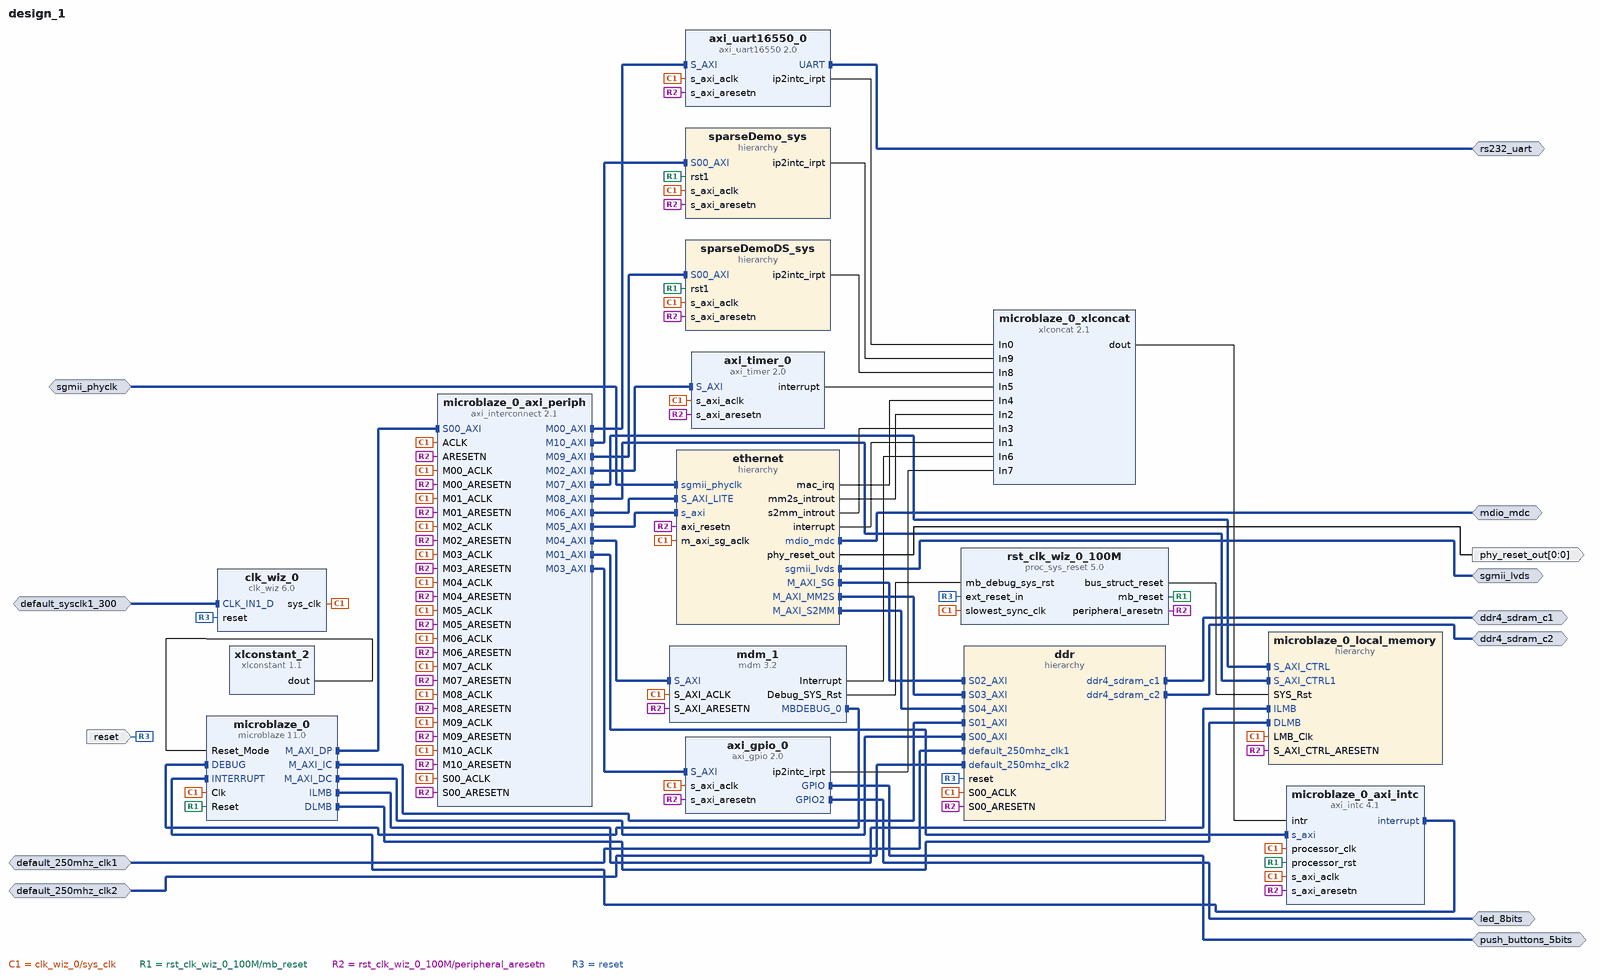
[diagram p0: block diagram of the top level]
# Vivado block design design_1, xcvu9p-flga2104-2L-e, Vivado 2019.1_AR72944
create_bd_design design_1

create_bd_intf_port -mode Master -vlnv xilinx.com:interface:ddr4_rtl:1.0 ddr4_sdram_c1
create_bd_intf_port -mode Slave -vlnv xilinx.com:interface:diff_clock_rtl:1.0 default_250mhz_clk1
set_property -dict {CONFIG.FREQ_HZ 250000000} [get_bd_intf_ports default_250mhz_clk1]
create_bd_intf_port -mode Master -vlnv xilinx.com:interface:ddr4_rtl:1.0 ddr4_sdram_c2
create_bd_intf_port -mode Slave -vlnv xilinx.com:interface:diff_clock_rtl:1.0 default_250mhz_clk2
set_property -dict {CONFIG.FREQ_HZ 250000000} [get_bd_intf_ports default_250mhz_clk2]
create_bd_intf_port -mode Master -vlnv xilinx.com:interface:uart_rtl:1.0 rs232_uart
create_bd_intf_port -mode Slave -vlnv xilinx.com:interface:diff_clock_rtl:1.0 default_sysclk1_300
set_property -dict {CONFIG.FREQ_HZ 300000000} [get_bd_intf_ports default_sysclk1_300]
create_bd_intf_port -mode Master -vlnv xilinx.com:interface:gpio_rtl:1.0 push_buttons_5bits
create_bd_intf_port -mode Master -vlnv xilinx.com:interface:gpio_rtl:1.0 led_8bits
create_bd_intf_port -mode Master -vlnv xilinx.com:interface:sgmii_rtl:1.0 sgmii_lvds
create_bd_intf_port -mode Master -vlnv xilinx.com:interface:mdio_rtl:1.0 mdio_mdc
create_bd_intf_port -mode Slave -vlnv xilinx.com:interface:diff_clock_rtl:1.0 sgmii_phyclk
set_property -dict {CONFIG.FREQ_HZ 625000000} [get_bd_intf_ports sgmii_phyclk]
create_bd_port -dir I -type rst reset
set_property -dict {CONFIG.POLARITY ACTIVE_HIGH} [get_bd_ports reset]
create_bd_port -dir O -from 0 -to 0 -type rst phy_reset_out

create_bd_cell -type ip -vlnv xilinx.com:ip:clk_wiz:6.0 clk_wiz_0
set_property -dict [list \
  CONFIG.CLKOUT1_JITTER 93.717 \
  CONFIG.CLKOUT1_REQUESTED_OUT_FREQ 150 \
  CONFIG.CLK_IN1_BOARD_INTERFACE default_sysclk1_300 \
  CONFIG.CLK_OUT1_PORT sys_clk \
  CONFIG.MMCM_CLKOUT0_DIVIDE_F 8.000 \
  CONFIG.RESET_BOARD_INTERFACE reset \
  CONFIG.USE_BOARD_FLOW true \
  CONFIG.USE_LOCKED false \
] [get_bd_cells clk_wiz_0]
create_bd_cell -type ip -vlnv xilinx.com:ip:xlconcat:2.1 microblaze_0_xlconcat
set_property -dict {CONFIG.NUM_PORTS 10} [get_bd_cells microblaze_0_xlconcat]
create_bd_cell -type ip -vlnv xilinx.com:ip:mdm:3.2 mdm_1
set_property -dict [list \
  CONFIG.C_ADDR_SIZE 32 \
  CONFIG.C_DBG_MEM_ACCESS 0 \
  CONFIG.C_M_AXI_ADDR_WIDTH 32 \
  CONFIG.C_USE_CROSS_TRIGGER 0 \
  CONFIG.C_USE_UART 1 \
] [get_bd_cells mdm_1]
create_bd_cell -type ip -vlnv xilinx.com:ip:proc_sys_reset:5.0 rst_clk_wiz_0_100M
set_property -dict {CONFIG.RESET_BOARD_INTERFACE reset CONFIG.USE_BOARD_FLOW true} [get_bd_cells rst_clk_wiz_0_100M]
create_bd_cell -type ip -vlnv xilinx.com:ip:xlconstant:1.1 xlconstant_2
set_property -dict {CONFIG.CONST_VAL 0b10 CONFIG.CONST_WIDTH 2} [get_bd_cells xlconstant_2]
create_bd_cell -type ip -vlnv xilinx.com:ip:microblaze:11.0 microblaze_0
set_property -dict [list \
  CONFIG.C_ADDR_SIZE 36 \
  CONFIG.C_ADDR_TAG_BITS 16 \
  CONFIG.C_CACHE_BYTE_SIZE 65536 \
  CONFIG.C_DATA_SIZE 64 \
  CONFIG.C_DCACHE_ADDR_TAG 16 \
  CONFIG.C_DCACHE_BYTE_SIZE 65536 \
  CONFIG.C_DCACHE_DATA_WIDTH 2 \
  CONFIG.C_DCACHE_USE_WRITEBACK 1 \
  CONFIG.C_DEBUG_ENABLED 1 \
  CONFIG.C_DIV_ZERO_EXCEPTION 1 \
  CONFIG.C_D_AXI 1 \
  CONFIG.C_D_LMB 1 \
  CONFIG.C_ENABLE_DISCRETE_PORTS 1 \
  CONFIG.C_FPU_EXCEPTION 1 \
  CONFIG.C_ICACHE_LINE_LEN 8 \
  CONFIG.C_ICACHE_STREAMS 1 \
  CONFIG.C_ICACHE_VICTIMS 8 \
  CONFIG.C_ILL_OPCODE_EXCEPTION 1 \
  CONFIG.C_I_LMB 1 \
  CONFIG.C_MMU_DTLB_SIZE 8 \
  CONFIG.C_MMU_ITLB_SIZE 8 \
  CONFIG.C_MMU_ZONES 2 \
  CONFIG.C_M_AXI_D_BUS_EXCEPTION 1 \
  CONFIG.C_M_AXI_I_BUS_EXCEPTION 1 \
  CONFIG.C_NUMBER_OF_PC_BRK 8 \
  CONFIG.C_NUMBER_OF_RD_ADDR_BRK 4 \
  CONFIG.C_NUMBER_OF_WR_ADDR_BRK 4 \
  CONFIG.C_OPCODE_0x0_ILLEGAL 1 \
  CONFIG.C_PVR 2 \
  CONFIG.C_UNALIGNED_EXCEPTIONS 1 \
  CONFIG.C_USE_BARREL 1 \
  CONFIG.C_USE_BRANCH_TARGET_CACHE 1 \
  CONFIG.C_USE_DCACHE 1 \
  CONFIG.C_USE_DIV 1 \
  CONFIG.C_USE_FPU 2 \
  CONFIG.C_USE_HW_MUL 2 \
  CONFIG.C_USE_ICACHE 1 \
  CONFIG.C_USE_MMU 3 \
  CONFIG.C_USE_MSR_INSTR 1 \
  CONFIG.C_USE_PCMP_INSTR 1 \
  CONFIG.G_TEMPLATE_LIST 10 \
  CONFIG.G_USE_EXCEPTIONS 1 \
] [get_bd_cells microblaze_0]
create_bd_cell -type ip -vlnv xilinx.com:ip:axi_intc:4.1 microblaze_0_axi_intc
set_property -dict {CONFIG.C_HAS_FAST 1} [get_bd_cells microblaze_0_axi_intc]
create_bd_cell -type ip -vlnv xilinx.com:ip:axi_timer:2.0 axi_timer_0
create_bd_cell -type ip -vlnv xilinx.com:ip:axi_gpio:2.0 axi_gpio_0
set_property -dict [list \
  CONFIG.C_INTERRUPT_PRESENT 1 \
  CONFIG.GPIO2_BOARD_INTERFACE led_8bits \
  CONFIG.GPIO_BOARD_INTERFACE push_buttons_5bits \
  CONFIG.USE_BOARD_FLOW true \
] [get_bd_cells axi_gpio_0]
create_bd_cell -type ip -vlnv xilinx.com:ip:axi_uart16550:2.0 axi_uart16550_0
set_property -dict {CONFIG.UART_BOARD_INTERFACE rs232_uart CONFIG.USE_BOARD_FLOW true} [get_bd_cells axi_uart16550_0]
create_bd_cell -type ip -vlnv xilinx.com:ip:axi_interconnect:2.1 microblaze_0_axi_periph
set_property -dict {CONFIG.NUM_MI 11} [get_bd_cells microblaze_0_axi_periph]
create_bd_cell -type hier microblaze_0_local_memory
create_bd_cell -type hier ddr
create_bd_cell -type hier ethernet
create_bd_cell -type hier sparseDemo_sys
create_bd_cell -type hier sparseDemoDS_sys

# ---- hierarchy /microblaze_0_local_memory ----
current_bd_instance /microblaze_0_local_memory
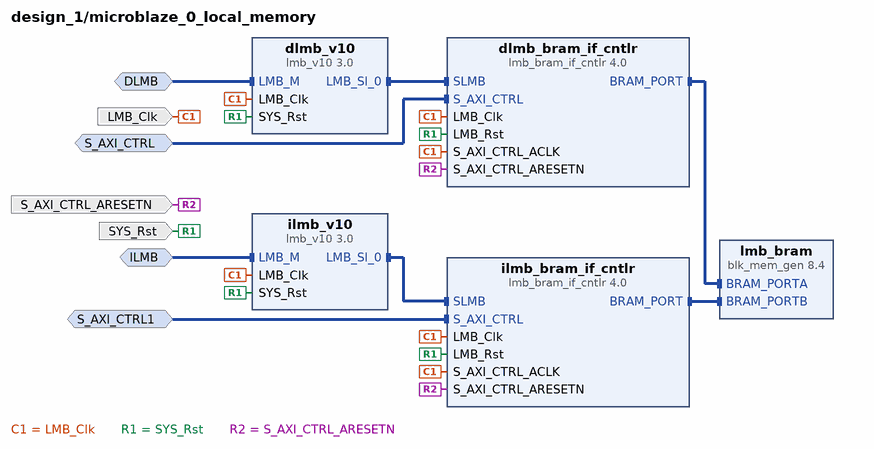
[diagram p1: block diagram inside /microblaze_0_local_memory]
create_bd_intf_pin -mode MirroredMaster -vlnv xilinx.com:interface:lmb_rtl:1.0 DLMB
create_bd_intf_pin -mode MirroredMaster -vlnv xilinx.com:interface:lmb_rtl:1.0 ILMB
create_bd_intf_pin -mode Slave -vlnv xilinx.com:interface:aximm_rtl:1.0 S_AXI_CTRL
create_bd_intf_pin -mode Slave -vlnv xilinx.com:interface:aximm_rtl:1.0 S_AXI_CTRL1
create_bd_pin -dir I -type clk LMB_Clk
create_bd_pin -dir I -type rst SYS_Rst
create_bd_pin -dir I -type rst S_AXI_CTRL_ARESETN

create_bd_cell -type ip -vlnv xilinx.com:ip:lmb_v10:3.0 dlmb_v10
create_bd_cell -type ip -vlnv xilinx.com:ip:lmb_v10:3.0 ilmb_v10
create_bd_cell -type ip -vlnv xilinx.com:ip:blk_mem_gen:8.4 lmb_bram
set_property -dict [list \
  CONFIG.Assume_Synchronous_Clk false \
  CONFIG.EN_SAFETY_CKT true \
  CONFIG.Memory_Type True_Dual_Port_RAM \
  CONFIG.Operating_Mode_A WRITE_FIRST \
  CONFIG.Operating_Mode_B WRITE_FIRST \
  CONFIG.PRIM_type_to_Implement BRAM \
  CONFIG.use_bram_block BRAM_Controller \
] [get_bd_cells lmb_bram]
create_bd_cell -type ip -vlnv xilinx.com:ip:lmb_bram_if_cntlr:4.0 dlmb_bram_if_cntlr
set_property -dict [list \
  CONFIG.C_CE_COUNTER_WIDTH 20 \
  CONFIG.C_CE_FAILING_REGISTERS 1 \
  CONFIG.C_ECC 1 \
  CONFIG.C_ECC_ONOFF_REGISTER 1 \
  CONFIG.C_ECC_STATUS_REGISTERS 1 \
  CONFIG.C_FAULT_INJECT 1 \
  CONFIG.C_INTERCONNECT 2 \
  CONFIG.C_NUM_LMB 1 \
  CONFIG.C_UE_FAILING_REGISTERS 1 \
] [get_bd_cells dlmb_bram_if_cntlr]
create_bd_cell -type ip -vlnv xilinx.com:ip:lmb_bram_if_cntlr:4.0 ilmb_bram_if_cntlr
set_property -dict [list \
  CONFIG.C_CE_COUNTER_WIDTH 20 \
  CONFIG.C_CE_FAILING_REGISTERS 1 \
  CONFIG.C_ECC 1 \
  CONFIG.C_ECC_ONOFF_REGISTER 1 \
  CONFIG.C_ECC_STATUS_REGISTERS 1 \
  CONFIG.C_INTERCONNECT 2 \
  CONFIG.C_UE_FAILING_REGISTERS 1 \
  CONFIG.C_WRITE_ACCESS 0 \
] [get_bd_cells ilmb_bram_if_cntlr]

# ---- hierarchy /ddr ----
current_bd_instance /ddr
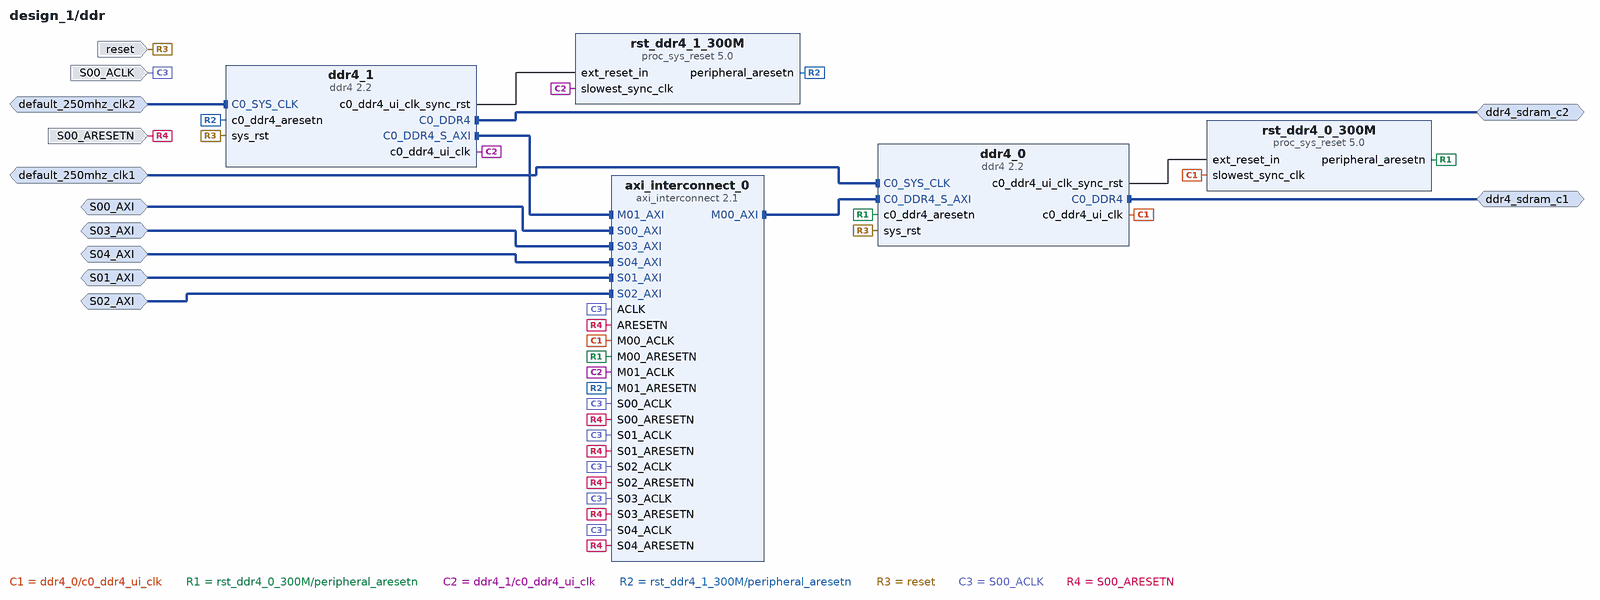
[diagram p2: block diagram inside /ddr]
create_bd_intf_pin -mode Slave -vlnv xilinx.com:interface:diff_clock_rtl:1.0 default_250mhz_clk1
create_bd_intf_pin -mode Master -vlnv xilinx.com:interface:ddr4_rtl:1.0 ddr4_sdram_c1
create_bd_intf_pin -mode Slave -vlnv xilinx.com:interface:diff_clock_rtl:1.0 default_250mhz_clk2
create_bd_intf_pin -mode Master -vlnv xilinx.com:interface:ddr4_rtl:1.0 ddr4_sdram_c2
create_bd_intf_pin -mode Slave -vlnv xilinx.com:interface:aximm_rtl:1.0 S00_AXI
create_bd_intf_pin -mode Slave -vlnv xilinx.com:interface:aximm_rtl:1.0 S01_AXI
create_bd_intf_pin -mode Slave -vlnv xilinx.com:interface:aximm_rtl:1.0 S02_AXI
create_bd_intf_pin -mode Slave -vlnv xilinx.com:interface:aximm_rtl:1.0 S03_AXI
create_bd_intf_pin -mode Slave -vlnv xilinx.com:interface:aximm_rtl:1.0 S04_AXI
create_bd_pin -dir I -type rst reset
create_bd_pin -dir I -type clk S00_ACLK
create_bd_pin -dir I -type rst S00_ARESETN

create_bd_cell -type ip -vlnv xilinx.com:ip:ddr4:2.2 ddr4_0
set_property -dict [list \
  CONFIG.ADDN_UI_CLKOUT1_FREQ_HZ None \
  CONFIG.C0.BANK_GROUP_WIDTH 1 \
  CONFIG.C0.DDR4_AxiAddressWidth 31 \
  CONFIG.C0_CLOCK_BOARD_INTERFACE default_250mhz_clk1 \
  CONFIG.C0_DDR4_BOARD_INTERFACE ddr4_sdram_c1 \
  CONFIG.RESET_BOARD_INTERFACE reset \
] [get_bd_cells ddr4_0]
create_bd_cell -type ip -vlnv xilinx.com:ip:proc_sys_reset:5.0 rst_ddr4_0_300M
create_bd_cell -type ip -vlnv xilinx.com:ip:ddr4:2.2 ddr4_1
set_property -dict [list \
  CONFIG.ADDN_UI_CLKOUT1_FREQ_HZ None \
  CONFIG.C0.BANK_GROUP_WIDTH 1 \
  CONFIG.C0.DDR4_AxiAddressWidth 31 \
  CONFIG.C0_CLOCK_BOARD_INTERFACE default_250mhz_clk2 \
  CONFIG.C0_DDR4_BOARD_INTERFACE ddr4_sdram_c2 \
  CONFIG.RESET_BOARD_INTERFACE reset \
] [get_bd_cells ddr4_1]
create_bd_cell -type ip -vlnv xilinx.com:ip:proc_sys_reset:5.0 rst_ddr4_1_300M
create_bd_cell -type ip -vlnv xilinx.com:ip:axi_interconnect:2.1 axi_interconnect_0
set_property -dict [list \
  CONFIG.ENABLE_ADVANCED_OPTIONS 0 \
  CONFIG.M00_HAS_DATA_FIFO 2 \
  CONFIG.M00_HAS_REGSLICE 4 \
  CONFIG.M01_HAS_DATA_FIFO 2 \
  CONFIG.M01_HAS_REGSLICE 4 \
  CONFIG.NUM_MI 2 \
  CONFIG.NUM_SI 5 \
  CONFIG.S00_HAS_DATA_FIFO 2 \
  CONFIG.S00_HAS_REGSLICE 4 \
  CONFIG.S01_HAS_DATA_FIFO 2 \
  CONFIG.S01_HAS_REGSLICE 4 \
  CONFIG.S02_HAS_DATA_FIFO 2 \
  CONFIG.S02_HAS_REGSLICE 4 \
  CONFIG.S03_HAS_DATA_FIFO 2 \
  CONFIG.S03_HAS_REGSLICE 4 \
  CONFIG.S04_HAS_DATA_FIFO 2 \
  CONFIG.S04_HAS_REGSLICE 4 \
  CONFIG.STRATEGY 2 \
] [get_bd_cells axi_interconnect_0]

# ---- hierarchy /ethernet ----
current_bd_instance /ethernet
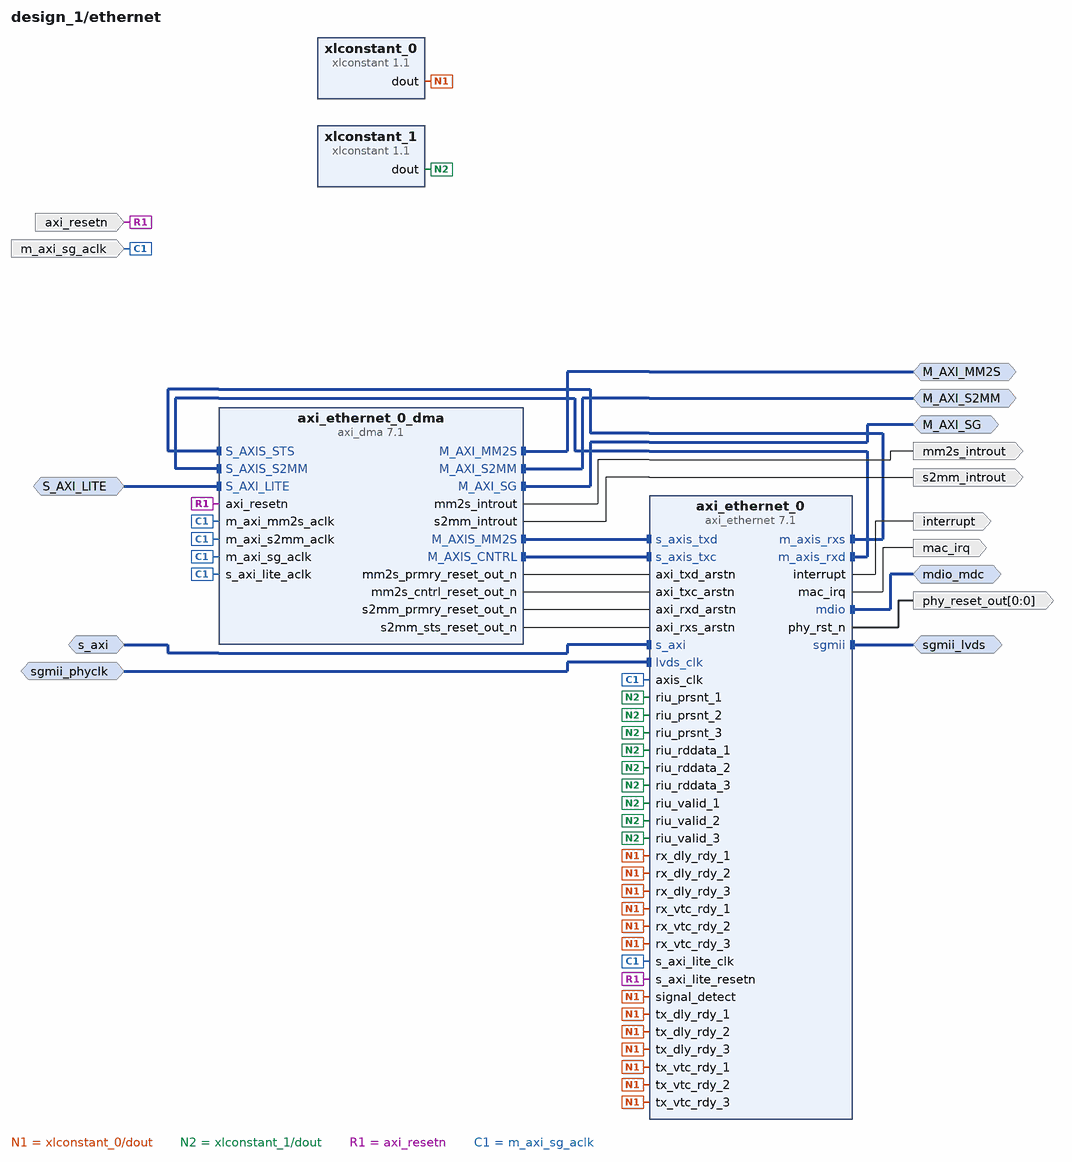
[diagram p3: block diagram inside /ethernet]
create_bd_intf_pin -mode Slave -vlnv xilinx.com:interface:aximm_rtl:1.0 s_axi
create_bd_intf_pin -mode Master -vlnv xilinx.com:interface:mdio_rtl:1.0 mdio_mdc
create_bd_intf_pin -mode Master -vlnv xilinx.com:interface:sgmii_rtl:1.0 sgmii_lvds
create_bd_intf_pin -mode Slave -vlnv xilinx.com:interface:diff_clock_rtl:1.0 sgmii_phyclk
create_bd_intf_pin -mode Slave -vlnv xilinx.com:interface:aximm_rtl:1.0 S_AXI_LITE
create_bd_intf_pin -mode Master -vlnv xilinx.com:interface:aximm_rtl:1.0 M_AXI_SG
create_bd_intf_pin -mode Master -vlnv xilinx.com:interface:aximm_rtl:1.0 M_AXI_MM2S
create_bd_intf_pin -mode Master -vlnv xilinx.com:interface:aximm_rtl:1.0 M_AXI_S2MM
create_bd_pin -dir I -type rst axi_resetn
create_bd_pin -dir I -type clk m_axi_sg_aclk
create_bd_pin -dir O -type intr mac_irq
create_bd_pin -dir O -type intr interrupt
create_bd_pin -dir O -from 0 -to 0 -type rst phy_reset_out
create_bd_pin -dir O -type intr mm2s_introut
create_bd_pin -dir O -type intr s2mm_introut

create_bd_cell -type ip -vlnv xilinx.com:ip:xlconstant:1.1 xlconstant_0
create_bd_cell -type ip -vlnv xilinx.com:ip:axi_ethernet:7.1 axi_ethernet_0
set_property -dict [list \
  CONFIG.DIFFCLK_BOARD_INTERFACE sgmii_phyclk \
  CONFIG.ETHERNET_BOARD_INTERFACE sgmii_lvds \
  CONFIG.MCAST_EXTEND true \
  CONFIG.MDIO_BOARD_INTERFACE mdio_mdc \
  CONFIG.PHYRST_BOARD_INTERFACE phy_reset_out \
  CONFIG.RXCSUM Full \
  CONFIG.RXVLAN_STRP true \
  CONFIG.RXVLAN_TAG true \
  CONFIG.RXVLAN_TRAN true \
  CONFIG.TXCSUM Full \
  CONFIG.TXVLAN_STRP true \
  CONFIG.TXVLAN_TAG true \
  CONFIG.TXVLAN_TRAN true \
  CONFIG.axiliteclkrate 200 \
  CONFIG.axisclkrate 200 \
] [get_bd_cells axi_ethernet_0]
create_bd_cell -type ip -vlnv xilinx.com:ip:axi_dma:7.1 axi_ethernet_0_dma
set_property -dict [list \
  CONFIG.c_addr_width 36 \
  CONFIG.c_include_mm2s_dre 1 \
  CONFIG.c_include_s2mm_dre 1 \
  CONFIG.c_sg_length_width 16 \
  CONFIG.c_sg_use_stsapp_length 1 \
] [get_bd_cells axi_ethernet_0_dma]
create_bd_cell -type ip -vlnv xilinx.com:ip:xlconstant:1.1 xlconstant_1
set_property -dict {CONFIG.CONST_VAL 0 CONFIG.CONST_WIDTH 16} [get_bd_cells xlconstant_1]

# ---- hierarchy /sparseDemo_sys ----
current_bd_instance /sparseDemo_sys
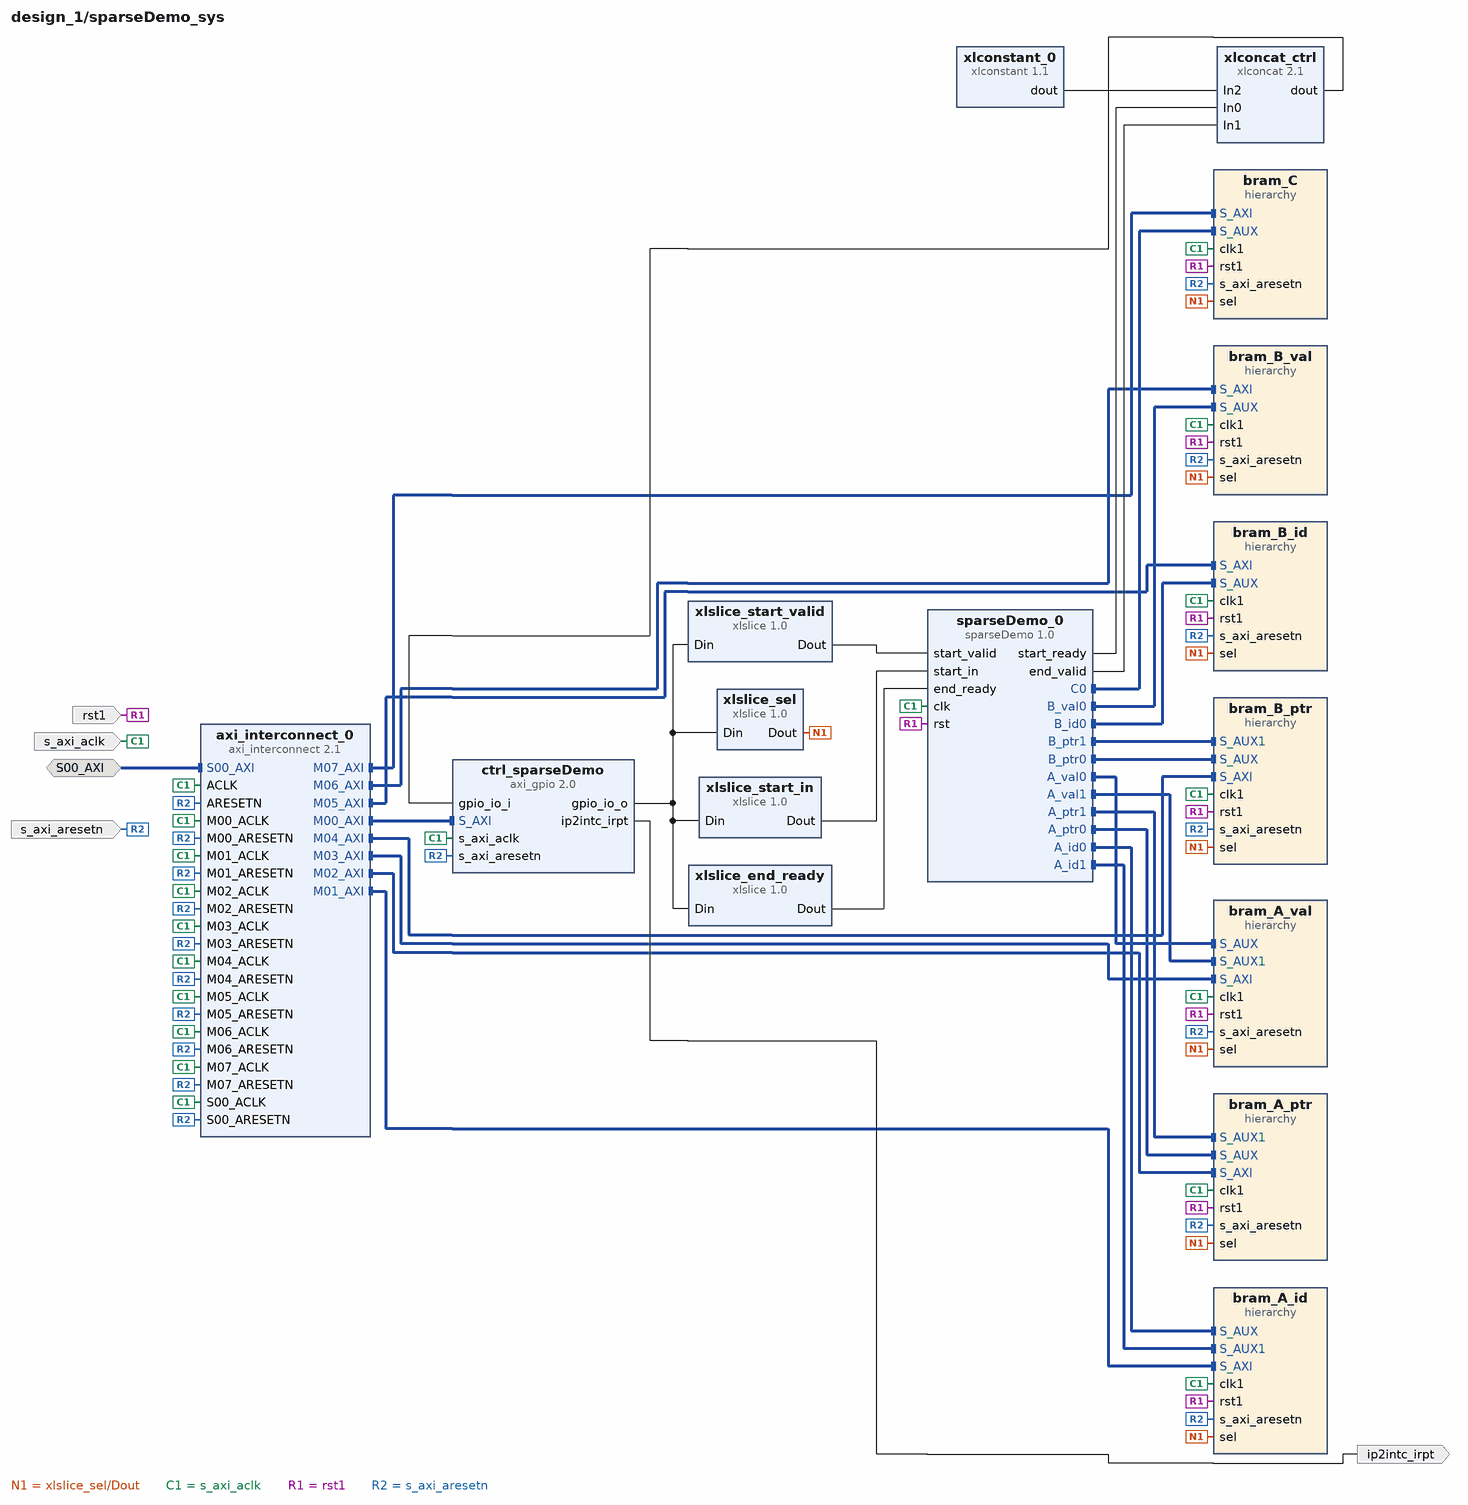
[diagram p4: block diagram inside /sparseDemo_sys]
create_bd_intf_pin -mode Slave -vlnv xilinx.com:interface:aximm_rtl:1.0 S00_AXI
create_bd_pin -dir I -type clk s_axi_aclk
create_bd_pin -dir I -type rst rst1
create_bd_pin -dir I -type rst s_axi_aresetn
create_bd_pin -dir O -type intr ip2intc_irpt

create_bd_cell -type ip -vlnv xilinx.com:ip:axi_interconnect:2.1 axi_interconnect_0
set_property -dict {CONFIG.NUM_MI 8} [get_bd_cells axi_interconnect_0]
create_bd_cell -type ip -vlnv xilinx.com:ip:xlconstant:1.1 xlconstant_0
set_property -dict {CONFIG.CONST_VAL 0 CONFIG.CONST_WIDTH 2} [get_bd_cells xlconstant_0]
create_bd_cell -type ip -vlnv xilinx.com:ip:axi_gpio:2.0 ctrl_sparseDemo
set_property -dict {CONFIG.C_GPIO_WIDTH 4 CONFIG.C_INTERRUPT_PRESENT 1} [get_bd_cells ctrl_sparseDemo]
create_bd_cell -type ip -vlnv xilinx.com:ip:xlslice:1.0 xlslice_sel
set_property -dict {CONFIG.DIN_FROM 3 CONFIG.DIN_TO 3 CONFIG.DIN_WIDTH 4} [get_bd_cells xlslice_sel]
create_bd_cell -type ip -vlnv xilinx.com:ip:xlslice:1.0 xlslice_start_valid
set_property -dict {CONFIG.DIN_FROM 1 CONFIG.DIN_TO 1 CONFIG.DIN_WIDTH 4} [get_bd_cells xlslice_start_valid]
create_bd_cell -type ip -vlnv xilinx.com:ip:xlconcat:2.1 xlconcat_ctrl
set_property -dict {CONFIG.NUM_PORTS 3} [get_bd_cells xlconcat_ctrl]
create_bd_cell -type ip -vlnv xilinx.com:ip:xlslice:1.0 xlslice_end_ready
set_property -dict {CONFIG.DIN_FROM 2 CONFIG.DIN_TO 2 CONFIG.DIN_WIDTH 4} [get_bd_cells xlslice_end_ready]
create_bd_cell -type ip -vlnv xilinx.com:ip:xlslice:1.0 xlslice_start_in
set_property -dict {CONFIG.DIN_FROM 0 CONFIG.DIN_TO 0 CONFIG.DIN_WIDTH 4} [get_bd_cells xlslice_start_in]
create_bd_cell -type hier bram_A_id
create_bd_cell -type hier bram_A_ptr
create_bd_cell -type hier bram_A_val
create_bd_cell -type hier bram_B_ptr
create_bd_cell -type hier bram_B_id
create_bd_cell -type hier bram_B_val
create_bd_cell -type hier bram_C
create_bd_cell -type ip -vlnv pkusc.org:user:sparseDemo:1.0 sparseDemo_0

# ---- hierarchy /sparseDemo_sys/bram_A_id ----
current_bd_instance /sparseDemo_sys/bram_A_id
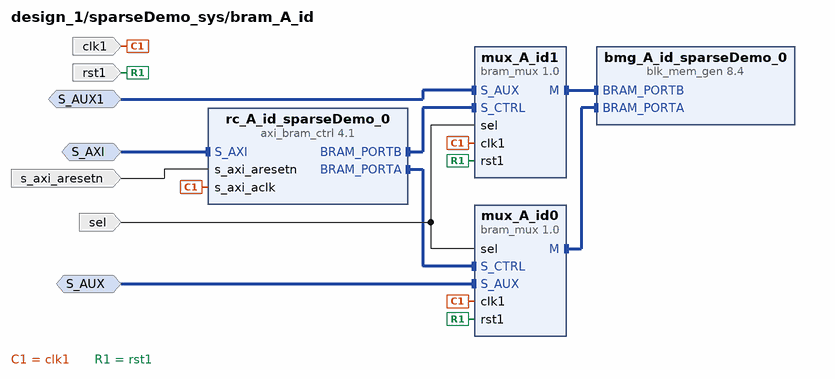
[diagram p5: block diagram inside /sparseDemo_sys/bram_A_id]
create_bd_intf_pin -mode Slave -vlnv xilinx.com:interface:aximm_rtl:1.0 S_AXI
create_bd_intf_pin -mode Slave -vlnv xilinx.com:interface:bram_rtl:1.0 S_AUX
create_bd_intf_pin -mode Slave -vlnv xilinx.com:interface:bram_rtl:1.0 S_AUX1
create_bd_pin -dir I -type clk clk1
create_bd_pin -dir I -type rst s_axi_aresetn
create_bd_pin -dir I sel
create_bd_pin -dir I -type rst rst1

create_bd_cell -type ip -vlnv xilinx.com:ip:axi_bram_ctrl:4.1 rc_A_id_sparseDemo_0
create_bd_cell -type ip -vlnv xilinx.com:ip:blk_mem_gen:8.4 bmg_A_id_sparseDemo_0
set_property -dict {CONFIG.Assume_Synchronous_Clk true CONFIG.Memory_Type True_Dual_Port_RAM} [get_bd_cells bmg_A_id_sparseDemo_0]
create_bd_cell -type ip -vlnv pkusc.org:user:bram_mux:1.0 mux_A_id0
create_bd_cell -type ip -vlnv pkusc.org:user:bram_mux:1.0 mux_A_id1

# ---- hierarchy /sparseDemo_sys/bram_A_ptr ----
current_bd_instance /sparseDemo_sys/bram_A_ptr
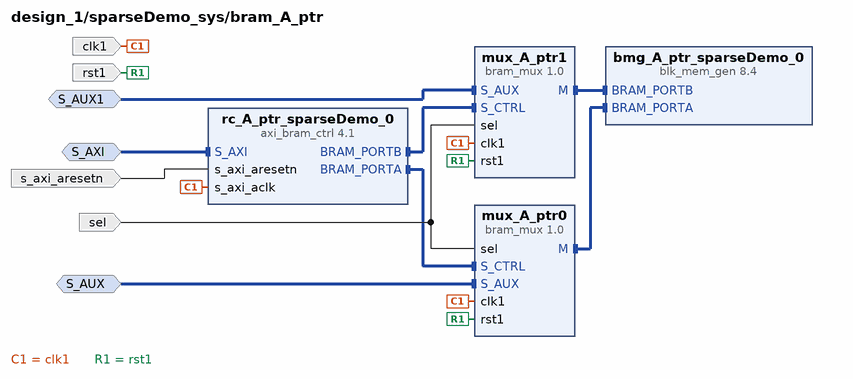
[diagram p6: block diagram inside /sparseDemo_sys/bram_A_ptr]
create_bd_intf_pin -mode Slave -vlnv xilinx.com:interface:aximm_rtl:1.0 S_AXI
create_bd_intf_pin -mode Slave -vlnv xilinx.com:interface:bram_rtl:1.0 S_AUX
create_bd_intf_pin -mode Slave -vlnv xilinx.com:interface:bram_rtl:1.0 S_AUX1
create_bd_pin -dir I -type clk clk1
create_bd_pin -dir I -type rst s_axi_aresetn
create_bd_pin -dir I sel
create_bd_pin -dir I -type rst rst1

create_bd_cell -type ip -vlnv xilinx.com:ip:axi_bram_ctrl:4.1 rc_A_ptr_sparseDemo_0
create_bd_cell -type ip -vlnv xilinx.com:ip:blk_mem_gen:8.4 bmg_A_ptr_sparseDemo_0
set_property -dict [list \
  CONFIG.Assume_Synchronous_Clk true \
  CONFIG.Memory_Type True_Dual_Port_RAM \
] [get_bd_cells bmg_A_ptr_sparseDemo_0]
create_bd_cell -type ip -vlnv pkusc.org:user:bram_mux:1.0 mux_A_ptr0
create_bd_cell -type ip -vlnv pkusc.org:user:bram_mux:1.0 mux_A_ptr1

# ---- hierarchy /sparseDemo_sys/bram_A_val ----
current_bd_instance /sparseDemo_sys/bram_A_val
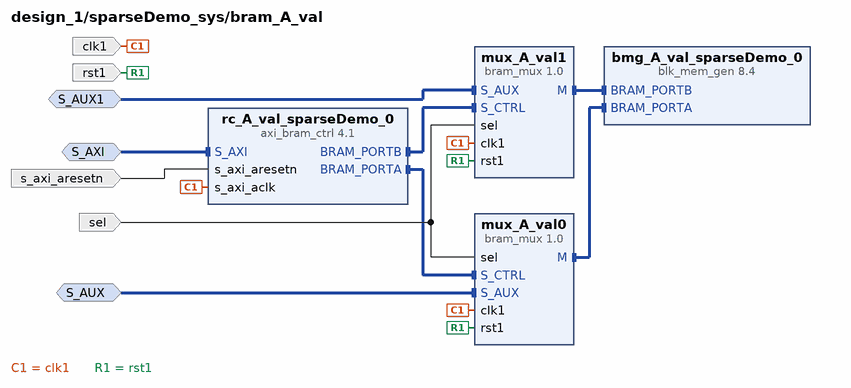
[diagram p7: block diagram inside /sparseDemo_sys/bram_A_val]
create_bd_intf_pin -mode Slave -vlnv xilinx.com:interface:aximm_rtl:1.0 S_AXI
create_bd_intf_pin -mode Slave -vlnv xilinx.com:interface:bram_rtl:1.0 S_AUX
create_bd_intf_pin -mode Slave -vlnv xilinx.com:interface:bram_rtl:1.0 S_AUX1
create_bd_pin -dir I -type clk clk1
create_bd_pin -dir I -type rst s_axi_aresetn
create_bd_pin -dir I sel
create_bd_pin -dir I -type rst rst1

create_bd_cell -type ip -vlnv xilinx.com:ip:axi_bram_ctrl:4.1 rc_A_val_sparseDemo_0
create_bd_cell -type ip -vlnv xilinx.com:ip:blk_mem_gen:8.4 bmg_A_val_sparseDemo_0
set_property -dict [list \
  CONFIG.Assume_Synchronous_Clk true \
  CONFIG.Memory_Type True_Dual_Port_RAM \
] [get_bd_cells bmg_A_val_sparseDemo_0]
create_bd_cell -type ip -vlnv pkusc.org:user:bram_mux:1.0 mux_A_val0
create_bd_cell -type ip -vlnv pkusc.org:user:bram_mux:1.0 mux_A_val1

# ---- hierarchy /sparseDemo_sys/bram_B_ptr ----
current_bd_instance /sparseDemo_sys/bram_B_ptr
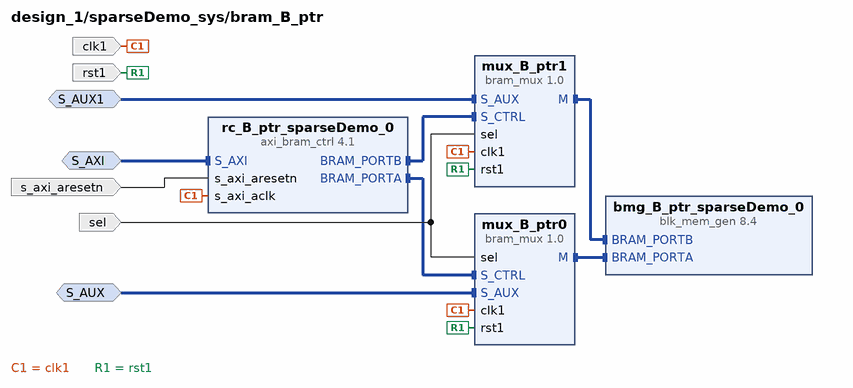
[diagram p8: block diagram inside /sparseDemo_sys/bram_B_ptr]
create_bd_intf_pin -mode Slave -vlnv xilinx.com:interface:aximm_rtl:1.0 S_AXI
create_bd_intf_pin -mode Slave -vlnv xilinx.com:interface:bram_rtl:1.0 S_AUX
create_bd_intf_pin -mode Slave -vlnv xilinx.com:interface:bram_rtl:1.0 S_AUX1
create_bd_pin -dir I -type clk clk1
create_bd_pin -dir I -type rst s_axi_aresetn
create_bd_pin -dir I sel
create_bd_pin -dir I -type rst rst1

create_bd_cell -type ip -vlnv xilinx.com:ip:axi_bram_ctrl:4.1 rc_B_ptr_sparseDemo_0
create_bd_cell -type ip -vlnv xilinx.com:ip:blk_mem_gen:8.4 bmg_B_ptr_sparseDemo_0
set_property -dict [list \
  CONFIG.Assume_Synchronous_Clk true \
  CONFIG.Memory_Type True_Dual_Port_RAM \
] [get_bd_cells bmg_B_ptr_sparseDemo_0]
create_bd_cell -type ip -vlnv pkusc.org:user:bram_mux:1.0 mux_B_ptr0
create_bd_cell -type ip -vlnv pkusc.org:user:bram_mux:1.0 mux_B_ptr1

# ---- hierarchy /sparseDemo_sys/bram_B_id ----
current_bd_instance /sparseDemo_sys/bram_B_id
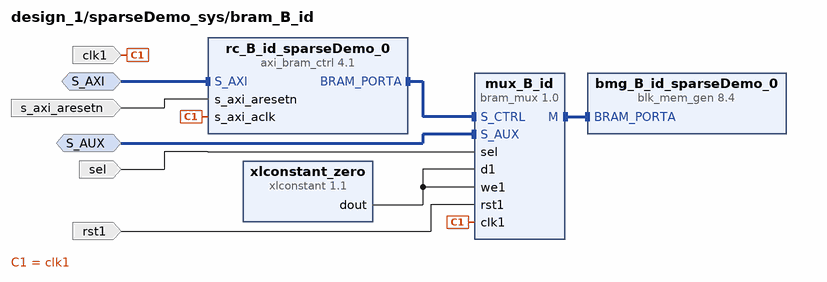
[diagram p9: block diagram inside /sparseDemo_sys/bram_B_id]
create_bd_intf_pin -mode Slave -vlnv xilinx.com:interface:aximm_rtl:1.0 S_AXI
create_bd_intf_pin -mode Slave -vlnv xilinx.com:interface:bram_rtl:1.0 S_AUX
create_bd_pin -dir I -type clk clk1
create_bd_pin -dir I -type rst s_axi_aresetn
create_bd_pin -dir I sel
create_bd_pin -dir I -type rst rst1

create_bd_cell -type ip -vlnv xilinx.com:ip:axi_bram_ctrl:4.1 rc_B_id_sparseDemo_0
set_property -dict {CONFIG.SINGLE_PORT_BRAM 1} [get_bd_cells rc_B_id_sparseDemo_0]
create_bd_cell -type ip -vlnv xilinx.com:ip:blk_mem_gen:8.4 bmg_B_id_sparseDemo_0
create_bd_cell -type ip -vlnv xilinx.com:ip:xlconstant:1.1 xlconstant_zero
set_property -dict {CONFIG.CONST_VAL 0 CONFIG.CONST_WIDTH 32} [get_bd_cells xlconstant_zero]
create_bd_cell -type ip -vlnv pkusc.org:user:bram_mux:1.0 mux_B_id

# ---- hierarchy /sparseDemo_sys/bram_B_val ----
current_bd_instance /sparseDemo_sys/bram_B_val
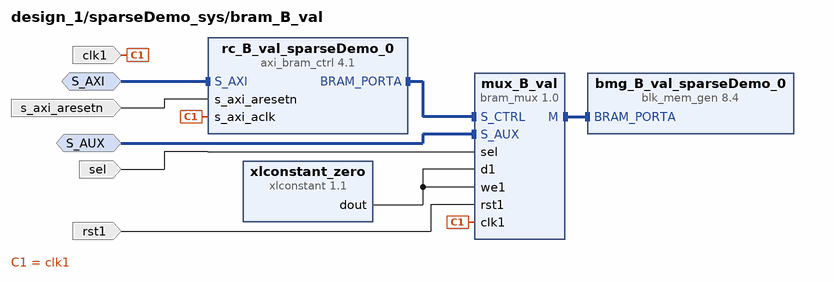
[diagram p10: block diagram inside /sparseDemo_sys/bram_B_val]
create_bd_intf_pin -mode Slave -vlnv xilinx.com:interface:aximm_rtl:1.0 S_AXI
create_bd_intf_pin -mode Slave -vlnv xilinx.com:interface:bram_rtl:1.0 S_AUX
create_bd_pin -dir I -type clk clk1
create_bd_pin -dir I -type rst s_axi_aresetn
create_bd_pin -dir I sel
create_bd_pin -dir I -type rst rst1

create_bd_cell -type ip -vlnv xilinx.com:ip:axi_bram_ctrl:4.1 rc_B_val_sparseDemo_0
set_property -dict {CONFIG.SINGLE_PORT_BRAM 1} [get_bd_cells rc_B_val_sparseDemo_0]
create_bd_cell -type ip -vlnv xilinx.com:ip:blk_mem_gen:8.4 bmg_B_val_sparseDemo_0
create_bd_cell -type ip -vlnv xilinx.com:ip:xlconstant:1.1 xlconstant_zero
set_property -dict {CONFIG.CONST_VAL 0 CONFIG.CONST_WIDTH 32} [get_bd_cells xlconstant_zero]
create_bd_cell -type ip -vlnv pkusc.org:user:bram_mux:1.0 mux_B_val

# ---- hierarchy /sparseDemo_sys/bram_C ----
current_bd_instance /sparseDemo_sys/bram_C
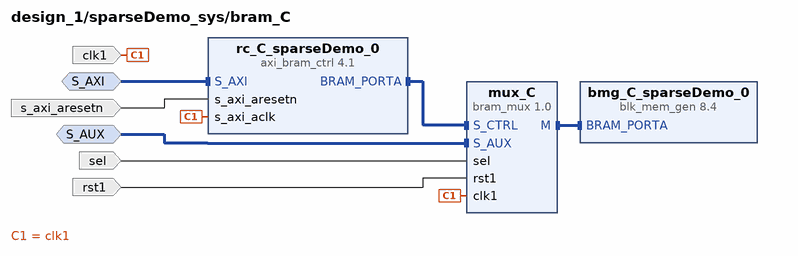
[diagram p11: block diagram inside /sparseDemo_sys/bram_C]
create_bd_intf_pin -mode Slave -vlnv xilinx.com:interface:aximm_rtl:1.0 S_AXI
create_bd_intf_pin -mode Slave -vlnv xilinx.com:interface:bram_rtl:1.0 S_AUX
create_bd_pin -dir I -type clk clk1
create_bd_pin -dir I -type rst s_axi_aresetn
create_bd_pin -dir I sel
create_bd_pin -dir I -type rst rst1

create_bd_cell -type ip -vlnv xilinx.com:ip:axi_bram_ctrl:4.1 rc_C_sparseDemo_0
set_property -dict {CONFIG.SINGLE_PORT_BRAM 1} [get_bd_cells rc_C_sparseDemo_0]
create_bd_cell -type ip -vlnv xilinx.com:ip:blk_mem_gen:8.4 bmg_C_sparseDemo_0
create_bd_cell -type ip -vlnv pkusc.org:user:bram_mux:1.0 mux_C

# ---- hierarchy /sparseDemoDS_sys ----
current_bd_instance /sparseDemoDS_sys
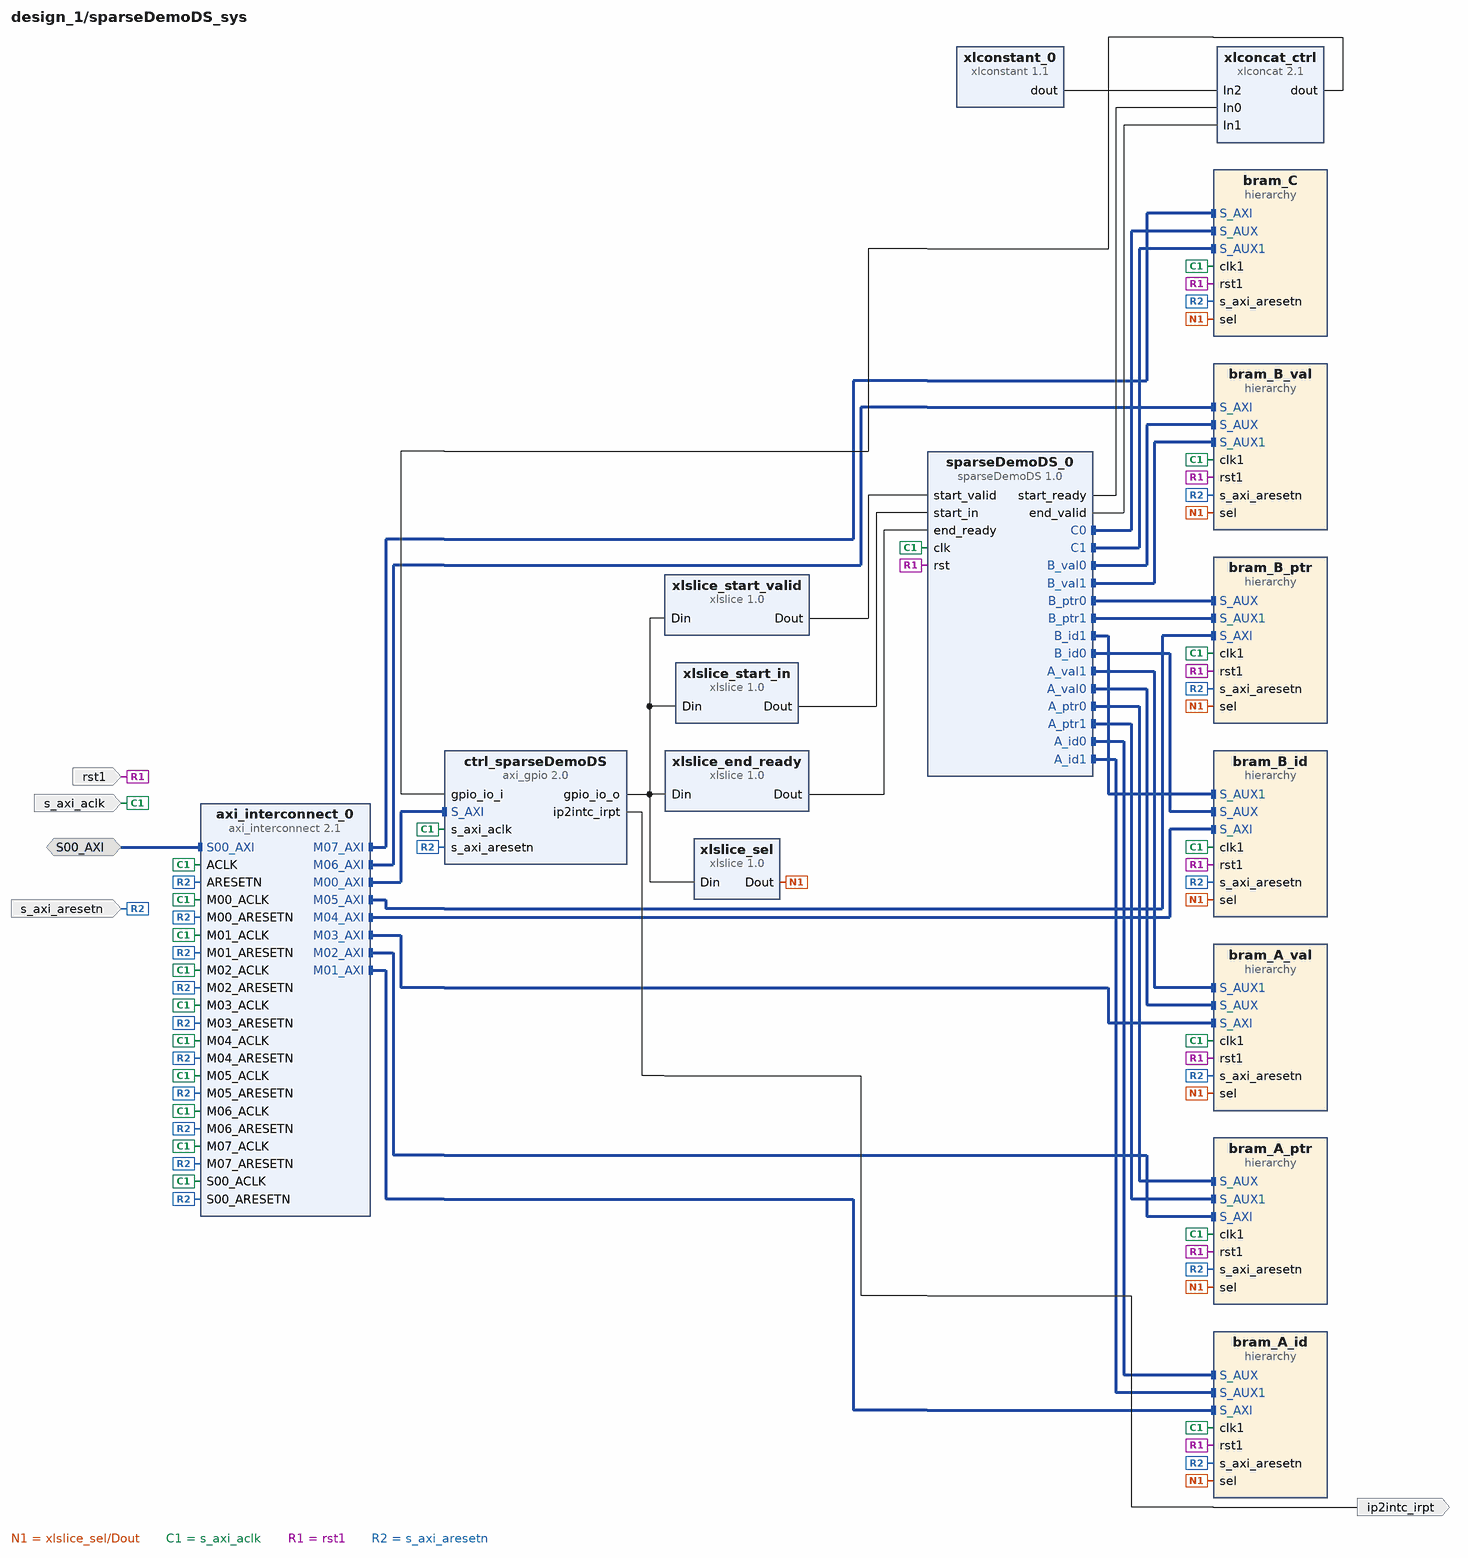
[diagram p12: block diagram inside /sparseDemoDS_sys]
create_bd_intf_pin -mode Slave -vlnv xilinx.com:interface:aximm_rtl:1.0 S00_AXI
create_bd_pin -dir I -type clk s_axi_aclk
create_bd_pin -dir I -type rst rst1
create_bd_pin -dir I -type rst s_axi_aresetn
create_bd_pin -dir O -type intr ip2intc_irpt

create_bd_cell -type ip -vlnv pkusc.org:user:sparseDemoDS:1.0 sparseDemoDS_0
create_bd_cell -type ip -vlnv xilinx.com:ip:axi_interconnect:2.1 axi_interconnect_0
set_property -dict {CONFIG.NUM_MI 8} [get_bd_cells axi_interconnect_0]
create_bd_cell -type ip -vlnv xilinx.com:ip:xlconstant:1.1 xlconstant_0
set_property -dict {CONFIG.CONST_VAL 0 CONFIG.CONST_WIDTH 2} [get_bd_cells xlconstant_0]
create_bd_cell -type ip -vlnv xilinx.com:ip:axi_gpio:2.0 ctrl_sparseDemoDS
set_property -dict {CONFIG.C_GPIO_WIDTH 4 CONFIG.C_INTERRUPT_PRESENT 1} [get_bd_cells ctrl_sparseDemoDS]
create_bd_cell -type ip -vlnv xilinx.com:ip:xlslice:1.0 xlslice_sel
set_property -dict {CONFIG.DIN_FROM 3 CONFIG.DIN_TO 3 CONFIG.DIN_WIDTH 4} [get_bd_cells xlslice_sel]
create_bd_cell -type ip -vlnv xilinx.com:ip:xlslice:1.0 xlslice_start_valid
set_property -dict {CONFIG.DIN_FROM 1 CONFIG.DIN_TO 1 CONFIG.DIN_WIDTH 4} [get_bd_cells xlslice_start_valid]
create_bd_cell -type ip -vlnv xilinx.com:ip:xlconcat:2.1 xlconcat_ctrl
set_property -dict {CONFIG.NUM_PORTS 3} [get_bd_cells xlconcat_ctrl]
create_bd_cell -type ip -vlnv xilinx.com:ip:xlslice:1.0 xlslice_end_ready
set_property -dict {CONFIG.DIN_FROM 2 CONFIG.DIN_TO 2 CONFIG.DIN_WIDTH 4} [get_bd_cells xlslice_end_ready]
create_bd_cell -type ip -vlnv xilinx.com:ip:xlslice:1.0 xlslice_start_in
set_property -dict {CONFIG.DIN_FROM 0 CONFIG.DIN_TO 0 CONFIG.DIN_WIDTH 4} [get_bd_cells xlslice_start_in]
create_bd_cell -type hier bram_A_id
create_bd_cell -type hier bram_A_ptr
create_bd_cell -type hier bram_A_val
create_bd_cell -type hier bram_B_id
create_bd_cell -type hier bram_B_ptr
create_bd_cell -type hier bram_B_val
create_bd_cell -type hier bram_C

# ---- hierarchy /sparseDemoDS_sys/bram_A_id ----
current_bd_instance /sparseDemoDS_sys/bram_A_id
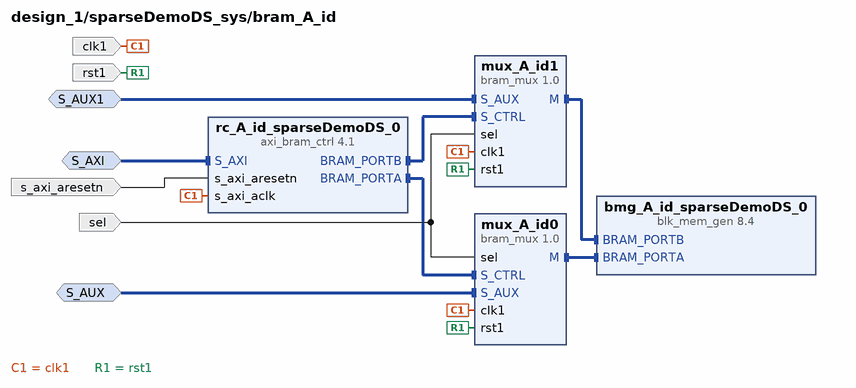
[diagram p13: block diagram inside /sparseDemoDS_sys/bram_A_id]
create_bd_intf_pin -mode Slave -vlnv xilinx.com:interface:aximm_rtl:1.0 S_AXI
create_bd_intf_pin -mode Slave -vlnv xilinx.com:interface:bram_rtl:1.0 S_AUX
create_bd_intf_pin -mode Slave -vlnv xilinx.com:interface:bram_rtl:1.0 S_AUX1
create_bd_pin -dir I -type clk clk1
create_bd_pin -dir I -type rst s_axi_aresetn
create_bd_pin -dir I sel
create_bd_pin -dir I -type rst rst1

create_bd_cell -type ip -vlnv xilinx.com:ip:axi_bram_ctrl:4.1 rc_A_id_sparseDemoDS_0
create_bd_cell -type ip -vlnv xilinx.com:ip:blk_mem_gen:8.4 bmg_A_id_sparseDemoDS_0
set_property -dict [list \
  CONFIG.Assume_Synchronous_Clk true \
  CONFIG.Memory_Type True_Dual_Port_RAM \
] [get_bd_cells bmg_A_id_sparseDemoDS_0]
create_bd_cell -type ip -vlnv pkusc.org:user:bram_mux:1.0 mux_A_id0
create_bd_cell -type ip -vlnv pkusc.org:user:bram_mux:1.0 mux_A_id1

# ---- hierarchy /sparseDemoDS_sys/bram_A_ptr ----
current_bd_instance /sparseDemoDS_sys/bram_A_ptr
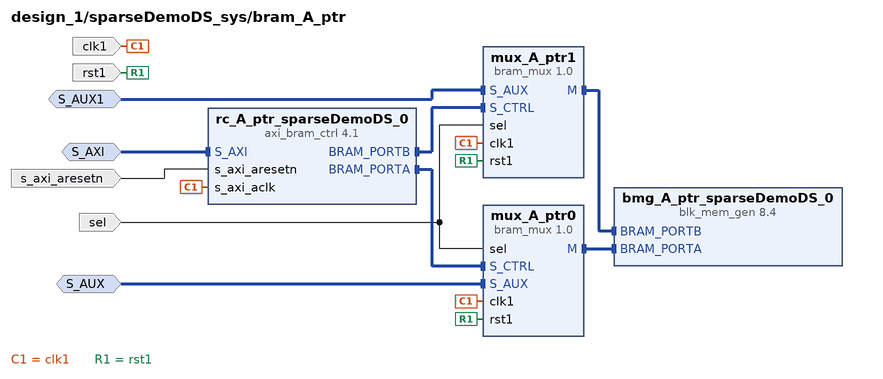
[diagram p14: block diagram inside /sparseDemoDS_sys/bram_A_ptr]
create_bd_intf_pin -mode Slave -vlnv xilinx.com:interface:aximm_rtl:1.0 S_AXI
create_bd_intf_pin -mode Slave -vlnv xilinx.com:interface:bram_rtl:1.0 S_AUX
create_bd_intf_pin -mode Slave -vlnv xilinx.com:interface:bram_rtl:1.0 S_AUX1
create_bd_pin -dir I -type clk clk1
create_bd_pin -dir I -type rst s_axi_aresetn
create_bd_pin -dir I sel
create_bd_pin -dir I -type rst rst1

create_bd_cell -type ip -vlnv xilinx.com:ip:axi_bram_ctrl:4.1 rc_A_ptr_sparseDemoDS_0
create_bd_cell -type ip -vlnv xilinx.com:ip:blk_mem_gen:8.4 bmg_A_ptr_sparseDemoDS_0
set_property -dict [list \
  CONFIG.Assume_Synchronous_Clk true \
  CONFIG.Memory_Type True_Dual_Port_RAM \
] [get_bd_cells bmg_A_ptr_sparseDemoDS_0]
create_bd_cell -type ip -vlnv pkusc.org:user:bram_mux:1.0 mux_A_ptr0
create_bd_cell -type ip -vlnv pkusc.org:user:bram_mux:1.0 mux_A_ptr1

# ---- hierarchy /sparseDemoDS_sys/bram_A_val ----
current_bd_instance /sparseDemoDS_sys/bram_A_val
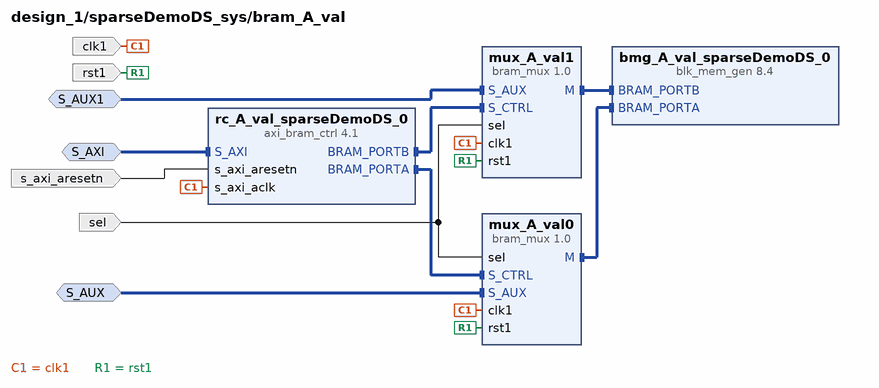
[diagram p15: block diagram inside /sparseDemoDS_sys/bram_A_val]
create_bd_intf_pin -mode Slave -vlnv xilinx.com:interface:aximm_rtl:1.0 S_AXI
create_bd_intf_pin -mode Slave -vlnv xilinx.com:interface:bram_rtl:1.0 S_AUX
create_bd_intf_pin -mode Slave -vlnv xilinx.com:interface:bram_rtl:1.0 S_AUX1
create_bd_pin -dir I -type clk clk1
create_bd_pin -dir I -type rst s_axi_aresetn
create_bd_pin -dir I sel
create_bd_pin -dir I -type rst rst1

create_bd_cell -type ip -vlnv xilinx.com:ip:axi_bram_ctrl:4.1 rc_A_val_sparseDemoDS_0
create_bd_cell -type ip -vlnv xilinx.com:ip:blk_mem_gen:8.4 bmg_A_val_sparseDemoDS_0
set_property -dict [list \
  CONFIG.Assume_Synchronous_Clk true \
  CONFIG.Memory_Type True_Dual_Port_RAM \
] [get_bd_cells bmg_A_val_sparseDemoDS_0]
create_bd_cell -type ip -vlnv pkusc.org:user:bram_mux:1.0 mux_A_val0
create_bd_cell -type ip -vlnv pkusc.org:user:bram_mux:1.0 mux_A_val1

# ---- hierarchy /sparseDemoDS_sys/bram_B_id ----
current_bd_instance /sparseDemoDS_sys/bram_B_id
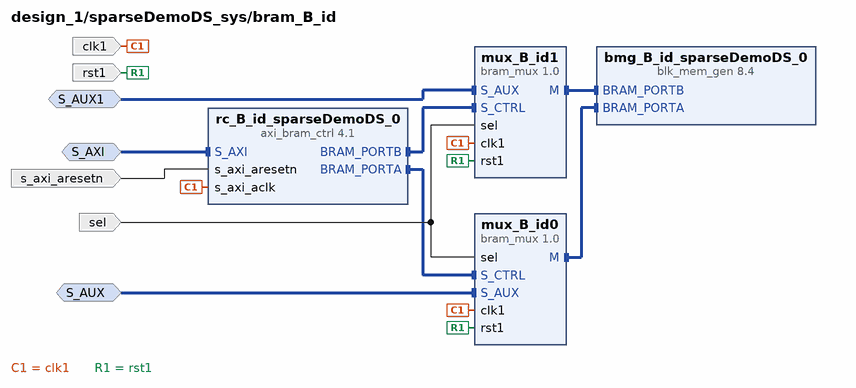
[diagram p16: block diagram inside /sparseDemoDS_sys/bram_B_id]
create_bd_intf_pin -mode Slave -vlnv xilinx.com:interface:aximm_rtl:1.0 S_AXI
create_bd_intf_pin -mode Slave -vlnv xilinx.com:interface:bram_rtl:1.0 S_AUX
create_bd_intf_pin -mode Slave -vlnv xilinx.com:interface:bram_rtl:1.0 S_AUX1
create_bd_pin -dir I -type clk clk1
create_bd_pin -dir I -type rst s_axi_aresetn
create_bd_pin -dir I sel
create_bd_pin -dir I -type rst rst1

create_bd_cell -type ip -vlnv xilinx.com:ip:axi_bram_ctrl:4.1 rc_B_id_sparseDemoDS_0
create_bd_cell -type ip -vlnv xilinx.com:ip:blk_mem_gen:8.4 bmg_B_id_sparseDemoDS_0
set_property -dict [list \
  CONFIG.Assume_Synchronous_Clk true \
  CONFIG.Memory_Type True_Dual_Port_RAM \
] [get_bd_cells bmg_B_id_sparseDemoDS_0]
create_bd_cell -type ip -vlnv pkusc.org:user:bram_mux:1.0 mux_B_id0
create_bd_cell -type ip -vlnv pkusc.org:user:bram_mux:1.0 mux_B_id1

# ---- hierarchy /sparseDemoDS_sys/bram_B_ptr ----
current_bd_instance /sparseDemoDS_sys/bram_B_ptr
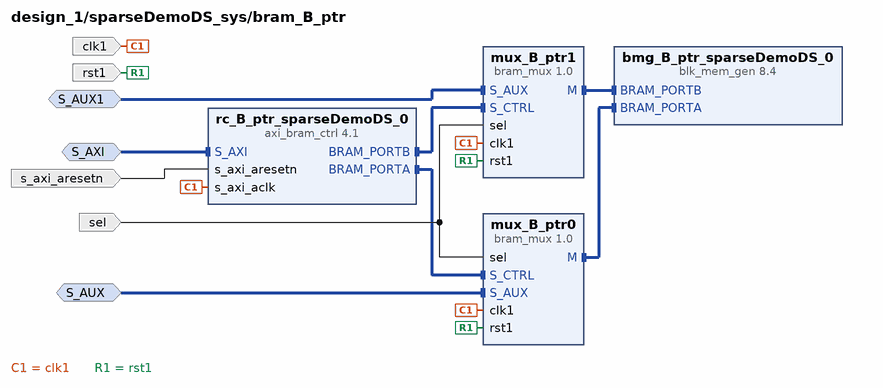
[diagram p17: block diagram inside /sparseDemoDS_sys/bram_B_ptr]
create_bd_intf_pin -mode Slave -vlnv xilinx.com:interface:aximm_rtl:1.0 S_AXI
create_bd_intf_pin -mode Slave -vlnv xilinx.com:interface:bram_rtl:1.0 S_AUX
create_bd_intf_pin -mode Slave -vlnv xilinx.com:interface:bram_rtl:1.0 S_AUX1
create_bd_pin -dir I -type clk clk1
create_bd_pin -dir I -type rst s_axi_aresetn
create_bd_pin -dir I sel
create_bd_pin -dir I -type rst rst1

create_bd_cell -type ip -vlnv xilinx.com:ip:axi_bram_ctrl:4.1 rc_B_ptr_sparseDemoDS_0
create_bd_cell -type ip -vlnv xilinx.com:ip:blk_mem_gen:8.4 bmg_B_ptr_sparseDemoDS_0
set_property -dict [list \
  CONFIG.Assume_Synchronous_Clk true \
  CONFIG.Memory_Type True_Dual_Port_RAM \
] [get_bd_cells bmg_B_ptr_sparseDemoDS_0]
create_bd_cell -type ip -vlnv pkusc.org:user:bram_mux:1.0 mux_B_ptr0
create_bd_cell -type ip -vlnv pkusc.org:user:bram_mux:1.0 mux_B_ptr1

# ---- hierarchy /sparseDemoDS_sys/bram_B_val ----
current_bd_instance /sparseDemoDS_sys/bram_B_val
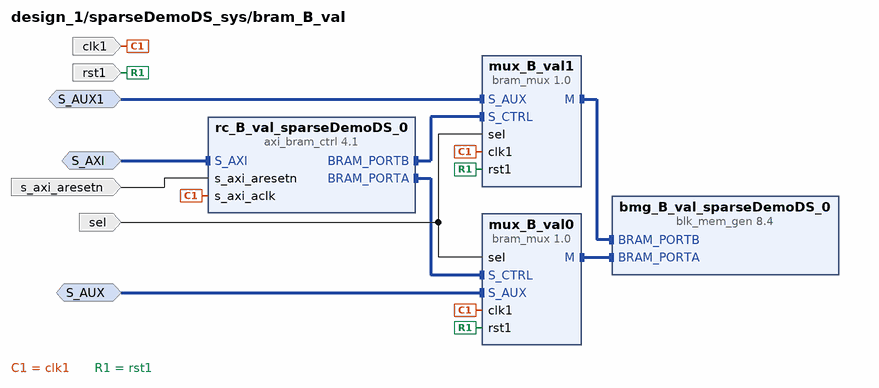
[diagram p18: block diagram inside /sparseDemoDS_sys/bram_B_val]
create_bd_intf_pin -mode Slave -vlnv xilinx.com:interface:aximm_rtl:1.0 S_AXI
create_bd_intf_pin -mode Slave -vlnv xilinx.com:interface:bram_rtl:1.0 S_AUX
create_bd_intf_pin -mode Slave -vlnv xilinx.com:interface:bram_rtl:1.0 S_AUX1
create_bd_pin -dir I -type clk clk1
create_bd_pin -dir I -type rst s_axi_aresetn
create_bd_pin -dir I sel
create_bd_pin -dir I -type rst rst1

create_bd_cell -type ip -vlnv xilinx.com:ip:axi_bram_ctrl:4.1 rc_B_val_sparseDemoDS_0
create_bd_cell -type ip -vlnv xilinx.com:ip:blk_mem_gen:8.4 bmg_B_val_sparseDemoDS_0
set_property -dict [list \
  CONFIG.Assume_Synchronous_Clk true \
  CONFIG.Memory_Type True_Dual_Port_RAM \
] [get_bd_cells bmg_B_val_sparseDemoDS_0]
create_bd_cell -type ip -vlnv pkusc.org:user:bram_mux:1.0 mux_B_val0
create_bd_cell -type ip -vlnv pkusc.org:user:bram_mux:1.0 mux_B_val1

# ---- hierarchy /sparseDemoDS_sys/bram_C ----
current_bd_instance /sparseDemoDS_sys/bram_C
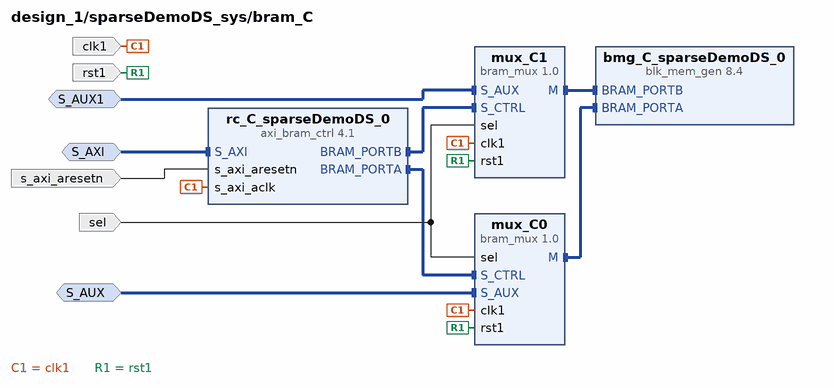
[diagram p19: block diagram inside /sparseDemoDS_sys/bram_C]
create_bd_intf_pin -mode Slave -vlnv xilinx.com:interface:aximm_rtl:1.0 S_AXI
create_bd_intf_pin -mode Slave -vlnv xilinx.com:interface:bram_rtl:1.0 S_AUX
create_bd_intf_pin -mode Slave -vlnv xilinx.com:interface:bram_rtl:1.0 S_AUX1
create_bd_pin -dir I -type clk clk1
create_bd_pin -dir I -type rst s_axi_aresetn
create_bd_pin -dir I sel
create_bd_pin -dir I -type rst rst1

create_bd_cell -type ip -vlnv xilinx.com:ip:axi_bram_ctrl:4.1 rc_C_sparseDemoDS_0
create_bd_cell -type ip -vlnv xilinx.com:ip:blk_mem_gen:8.4 bmg_C_sparseDemoDS_0
set_property -dict {CONFIG.Assume_Synchronous_Clk true CONFIG.Memory_Type True_Dual_Port_RAM} [get_bd_cells bmg_C_sparseDemoDS_0]
create_bd_cell -type ip -vlnv pkusc.org:user:bram_mux:1.0 mux_C0
create_bd_cell -type ip -vlnv pkusc.org:user:bram_mux:1.0 mux_C1

# ---- connections ----

current_bd_instance /microblaze_0_local_memory
connect_bd_intf_net [get_bd_intf_pins dlmb_bram_if_cntlr/BRAM_PORT] [get_bd_intf_pins lmb_bram/BRAM_PORTA]
connect_bd_intf_net [get_bd_intf_pins ilmb_v10/LMB_Sl_0] [get_bd_intf_pins ilmb_bram_if_cntlr/SLMB]
connect_bd_intf_net [get_bd_intf_pins S_AXI_CTRL1] [get_bd_intf_pins ilmb_bram_if_cntlr/S_AXI_CTRL]
connect_bd_intf_net [get_bd_intf_pins DLMB] [get_bd_intf_pins dlmb_v10/LMB_M]
connect_bd_intf_net [get_bd_intf_pins dlmb_v10/LMB_Sl_0] [get_bd_intf_pins dlmb_bram_if_cntlr/SLMB]
connect_bd_intf_net [get_bd_intf_pins S_AXI_CTRL] [get_bd_intf_pins dlmb_bram_if_cntlr/S_AXI_CTRL]
connect_bd_intf_net [get_bd_intf_pins ILMB] [get_bd_intf_pins ilmb_v10/LMB_M]
connect_bd_intf_net [get_bd_intf_pins ilmb_bram_if_cntlr/BRAM_PORT] [get_bd_intf_pins lmb_bram/BRAM_PORTB]
connect_bd_net -net microblaze_0_Clk [get_bd_pins LMB_Clk] \
  [get_bd_pins dlmb_v10/LMB_Clk] [get_bd_pins ilmb_v10/LMB_Clk] [get_bd_pins dlmb_bram_if_cntlr/LMB_Clk] \
  [get_bd_pins dlmb_bram_if_cntlr/S_AXI_CTRL_ACLK] [get_bd_pins ilmb_bram_if_cntlr/LMB_Clk] \
  [get_bd_pins ilmb_bram_if_cntlr/S_AXI_CTRL_ACLK]
connect_bd_net [get_bd_pins SYS_Rst] \
  [get_bd_pins dlmb_v10/SYS_Rst] [get_bd_pins ilmb_v10/SYS_Rst] [get_bd_pins dlmb_bram_if_cntlr/LMB_Rst] \
  [get_bd_pins ilmb_bram_if_cntlr/LMB_Rst]
connect_bd_net [get_bd_pins S_AXI_CTRL_ARESETN] \
  [get_bd_pins dlmb_bram_if_cntlr/S_AXI_CTRL_ARESETN] [get_bd_pins ilmb_bram_if_cntlr/S_AXI_CTRL_ARESETN]
set_property HDL_ATTRIBUTE.BMM_INFO_ADDRESS_SPACE {byte  0x00000000 40 > design_1 microblaze_0_local_memory/lmb_bram} [get_bd_cells dlmb_bram_if_cntlr]
set_property HDL_ATTRIBUTE.KEEP_HIERARCHY yes [get_bd_cells dlmb_bram_if_cntlr]

current_bd_instance /ddr
connect_bd_intf_net [get_bd_intf_pins ddr4_1/C0_DDR4_S_AXI] [get_bd_intf_pins axi_interconnect_0/M01_AXI]
connect_bd_intf_net [get_bd_intf_pins ddr4_sdram_c1] [get_bd_intf_pins ddr4_0/C0_DDR4]
connect_bd_intf_net [get_bd_intf_pins S00_AXI] [get_bd_intf_pins axi_interconnect_0/S00_AXI]
connect_bd_intf_net [get_bd_intf_pins S03_AXI] [get_bd_intf_pins axi_interconnect_0/S03_AXI]
connect_bd_intf_net [get_bd_intf_pins S04_AXI] [get_bd_intf_pins axi_interconnect_0/S04_AXI]
connect_bd_intf_net [get_bd_intf_pins default_250mhz_clk2] [get_bd_intf_pins ddr4_1/C0_SYS_CLK]
connect_bd_intf_net [get_bd_intf_pins default_250mhz_clk1] [get_bd_intf_pins ddr4_0/C0_SYS_CLK]
connect_bd_intf_net [get_bd_intf_pins S01_AXI] [get_bd_intf_pins axi_interconnect_0/S01_AXI]
connect_bd_intf_net [get_bd_intf_pins ddr4_sdram_c2] [get_bd_intf_pins ddr4_1/C0_DDR4]
connect_bd_intf_net [get_bd_intf_pins S02_AXI] [get_bd_intf_pins axi_interconnect_0/S02_AXI]
connect_bd_intf_net [get_bd_intf_pins axi_interconnect_0/M00_AXI] [get_bd_intf_pins ddr4_0/C0_DDR4_S_AXI]
connect_bd_net [get_bd_pins ddr4_0/c0_ddr4_ui_clk] [get_bd_pins rst_ddr4_0_300M/slowest_sync_clk] [get_bd_pins axi_interconnect_0/M00_ACLK]
connect_bd_net [get_bd_pins ddr4_0/c0_ddr4_ui_clk_sync_rst] [get_bd_pins rst_ddr4_0_300M/ext_reset_in]
connect_bd_net [get_bd_pins rst_ddr4_0_300M/peripheral_aresetn] [get_bd_pins axi_interconnect_0/M00_ARESETN] [get_bd_pins ddr4_0/c0_ddr4_aresetn]
connect_bd_net [get_bd_pins ddr4_1/c0_ddr4_ui_clk] [get_bd_pins rst_ddr4_1_300M/slowest_sync_clk] [get_bd_pins axi_interconnect_0/M01_ACLK]
connect_bd_net [get_bd_pins ddr4_1/c0_ddr4_ui_clk_sync_rst] [get_bd_pins rst_ddr4_1_300M/ext_reset_in]
connect_bd_net [get_bd_pins rst_ddr4_1_300M/peripheral_aresetn] [get_bd_pins axi_interconnect_0/M01_ARESETN] [get_bd_pins ddr4_1/c0_ddr4_aresetn]
connect_bd_net [get_bd_pins reset] [get_bd_pins ddr4_1/sys_rst] [get_bd_pins ddr4_0/sys_rst]
connect_bd_net -net microblaze_0_Clk [get_bd_pins S00_ACLK] \
  [get_bd_pins axi_interconnect_0/S00_ACLK] [get_bd_pins axi_interconnect_0/S01_ACLK] \
  [get_bd_pins axi_interconnect_0/S02_ACLK] [get_bd_pins axi_interconnect_0/S03_ACLK] \
  [get_bd_pins axi_interconnect_0/S04_ACLK] [get_bd_pins axi_interconnect_0/ACLK]
connect_bd_net -net rst_clk_wiz_0_100M_peripheral_aresetn [get_bd_pins S00_ARESETN] \
  [get_bd_pins axi_interconnect_0/S00_ARESETN] [get_bd_pins axi_interconnect_0/S01_ARESETN] \
  [get_bd_pins axi_interconnect_0/S02_ARESETN] [get_bd_pins axi_interconnect_0/S03_ARESETN] \
  [get_bd_pins axi_interconnect_0/S04_ARESETN] [get_bd_pins axi_interconnect_0/ARESETN]

current_bd_instance /ethernet
connect_bd_intf_net [get_bd_intf_pins M_AXI_SG] [get_bd_intf_pins axi_ethernet_0_dma/M_AXI_SG]
connect_bd_intf_net [get_bd_intf_pins M_AXI_S2MM] [get_bd_intf_pins axi_ethernet_0_dma/M_AXI_S2MM]
connect_bd_intf_net [get_bd_intf_pins axi_ethernet_0_dma/S_AXIS_STS] [get_bd_intf_pins axi_ethernet_0/m_axis_rxs]
connect_bd_intf_net [get_bd_intf_pins M_AXI_MM2S] [get_bd_intf_pins axi_ethernet_0_dma/M_AXI_MM2S]
connect_bd_intf_net [get_bd_intf_pins mdio_mdc] [get_bd_intf_pins axi_ethernet_0/mdio]
connect_bd_intf_net [get_bd_intf_pins s_axi] [get_bd_intf_pins axi_ethernet_0/s_axi]
connect_bd_intf_net [get_bd_intf_pins axi_ethernet_0_dma/M_AXIS_MM2S] [get_bd_intf_pins axi_ethernet_0/s_axis_txd]
connect_bd_intf_net [get_bd_intf_pins axi_ethernet_0_dma/S_AXIS_S2MM] [get_bd_intf_pins axi_ethernet_0/m_axis_rxd]
connect_bd_intf_net [get_bd_intf_pins axi_ethernet_0_dma/M_AXIS_CNTRL] [get_bd_intf_pins axi_ethernet_0/s_axis_txc]
connect_bd_intf_net [get_bd_intf_pins sgmii_lvds] [get_bd_intf_pins axi_ethernet_0/sgmii]
connect_bd_intf_net [get_bd_intf_pins sgmii_phyclk] [get_bd_intf_pins axi_ethernet_0/lvds_clk]
connect_bd_intf_net [get_bd_intf_pins S_AXI_LITE] [get_bd_intf_pins axi_ethernet_0_dma/S_AXI_LITE]
connect_bd_net [get_bd_pins xlconstant_0/dout] \
  [get_bd_pins axi_ethernet_0/signal_detect] [get_bd_pins axi_ethernet_0/rx_vtc_rdy_3] \
  [get_bd_pins axi_ethernet_0/tx_vtc_rdy_3] [get_bd_pins axi_ethernet_0/rx_dly_rdy_3] \
  [get_bd_pins axi_ethernet_0/tx_dly_rdy_3] [get_bd_pins axi_ethernet_0/rx_vtc_rdy_2] \
  [get_bd_pins axi_ethernet_0/tx_vtc_rdy_2] [get_bd_pins axi_ethernet_0/rx_dly_rdy_2] \
  [get_bd_pins axi_ethernet_0/tx_dly_rdy_2] [get_bd_pins axi_ethernet_0/rx_vtc_rdy_1] \
  [get_bd_pins axi_ethernet_0/tx_vtc_rdy_1] [get_bd_pins axi_ethernet_0/rx_dly_rdy_1] \
  [get_bd_pins axi_ethernet_0/tx_dly_rdy_1]
connect_bd_net [get_bd_pins axi_ethernet_0_dma/mm2s_prmry_reset_out_n] [get_bd_pins axi_ethernet_0/axi_txd_arstn]
connect_bd_net [get_bd_pins axi_ethernet_0_dma/mm2s_cntrl_reset_out_n] [get_bd_pins axi_ethernet_0/axi_txc_arstn]
connect_bd_net [get_bd_pins axi_ethernet_0_dma/s2mm_prmry_reset_out_n] [get_bd_pins axi_ethernet_0/axi_rxd_arstn]
connect_bd_net [get_bd_pins axi_ethernet_0_dma/s2mm_sts_reset_out_n] [get_bd_pins axi_ethernet_0/axi_rxs_arstn]
connect_bd_net [get_bd_pins xlconstant_1/dout] \
  [get_bd_pins axi_ethernet_0/riu_valid_3] [get_bd_pins axi_ethernet_0/riu_rddata_1] \
  [get_bd_pins axi_ethernet_0/riu_rddata_2] [get_bd_pins axi_ethernet_0/riu_rddata_3] \
  [get_bd_pins axi_ethernet_0/riu_prsnt_1] [get_bd_pins axi_ethernet_0/riu_prsnt_2] [get_bd_pins axi_ethernet_0/riu_prsnt_3] \
  [get_bd_pins axi_ethernet_0/riu_valid_1] [get_bd_pins axi_ethernet_0/riu_valid_2]
connect_bd_net -net rst_clk_wiz_0_100M_peripheral_aresetn [get_bd_pins axi_resetn] \
  [get_bd_pins axi_ethernet_0_dma/axi_resetn] [get_bd_pins axi_ethernet_0/s_axi_lite_resetn]
connect_bd_net -net microblaze_0_Clk [get_bd_pins m_axi_sg_aclk] \
  [get_bd_pins axi_ethernet_0_dma/m_axi_sg_aclk] [get_bd_pins axi_ethernet_0_dma/s_axi_lite_aclk] \
  [get_bd_pins axi_ethernet_0/axis_clk] [get_bd_pins axi_ethernet_0_dma/m_axi_s2mm_aclk] \
  [get_bd_pins axi_ethernet_0_dma/m_axi_mm2s_aclk] [get_bd_pins axi_ethernet_0/s_axi_lite_clk]
connect_bd_net -net periph_mac_irq [get_bd_pins axi_ethernet_0/mac_irq] [get_bd_pins mac_irq]
connect_bd_net -net periph_interrupt1 [get_bd_pins axi_ethernet_0/interrupt] [get_bd_pins interrupt]
connect_bd_net -net periph_phy_reset_out [get_bd_pins axi_ethernet_0/phy_rst_n] [get_bd_pins phy_reset_out]
connect_bd_net -net periph_mm2s_introut [get_bd_pins axi_ethernet_0_dma/mm2s_introut] [get_bd_pins mm2s_introut]
connect_bd_net -net periph_s2mm_introut [get_bd_pins axi_ethernet_0_dma/s2mm_introut] [get_bd_pins s2mm_introut]

current_bd_instance /sparseDemo_sys
connect_bd_intf_net [get_bd_intf_pins axi_interconnect_0/M05_AXI] [get_bd_intf_pins bram_B_id/S_AXI]
connect_bd_intf_net [get_bd_intf_pins sparseDemo_0/A_val0] [get_bd_intf_pins bram_A_val/S_AUX]
connect_bd_intf_net [get_bd_intf_pins sparseDemo_0/A_id0] [get_bd_intf_pins bram_A_id/S_AUX]
connect_bd_intf_net [get_bd_intf_pins sparseDemo_0/A_id1] [get_bd_intf_pins bram_A_id/S_AUX1]
connect_bd_intf_net [get_bd_intf_pins axi_interconnect_0/M06_AXI] [get_bd_intf_pins bram_B_val/S_AXI]
connect_bd_intf_net [get_bd_intf_pins sparseDemo_0/B_id0] [get_bd_intf_pins bram_B_id/S_AUX]
connect_bd_intf_net [get_bd_intf_pins sparseDemo_0/B_ptr1] [get_bd_intf_pins bram_B_ptr/S_AUX1]
connect_bd_intf_net [get_bd_intf_pins axi_interconnect_0/M01_AXI] [get_bd_intf_pins bram_A_id/S_AXI]
connect_bd_intf_net [get_bd_intf_pins axi_interconnect_0/M00_AXI] [get_bd_intf_pins ctrl_sparseDemo/S_AXI]
connect_bd_intf_net [get_bd_intf_pins sparseDemo_0/A_ptr1] [get_bd_intf_pins bram_A_ptr/S_AUX1]
connect_bd_intf_net [get_bd_intf_pins sparseDemo_0/A_ptr0] [get_bd_intf_pins bram_A_ptr/S_AUX]
connect_bd_intf_net [get_bd_intf_pins axi_interconnect_0/M04_AXI] [get_bd_intf_pins bram_B_ptr/S_AXI]
connect_bd_intf_net [get_bd_intf_pins sparseDemo_0/B_val0] [get_bd_intf_pins bram_B_val/S_AUX]
connect_bd_intf_net [get_bd_intf_pins axi_interconnect_0/M02_AXI] [get_bd_intf_pins bram_A_ptr/S_AXI]
connect_bd_intf_net [get_bd_intf_pins sparseDemo_0/C0] [get_bd_intf_pins bram_C/S_AUX]
connect_bd_intf_net [get_bd_intf_pins S00_AXI] [get_bd_intf_pins axi_interconnect_0/S00_AXI]
connect_bd_intf_net [get_bd_intf_pins axi_interconnect_0/M03_AXI] [get_bd_intf_pins bram_A_val/S_AXI]
connect_bd_intf_net [get_bd_intf_pins axi_interconnect_0/M07_AXI] [get_bd_intf_pins bram_C/S_AXI]
connect_bd_intf_net [get_bd_intf_pins sparseDemo_0/B_ptr0] [get_bd_intf_pins bram_B_ptr/S_AUX]
connect_bd_intf_net [get_bd_intf_pins sparseDemo_0/A_val1] [get_bd_intf_pins bram_A_val/S_AUX1]
connect_bd_net [get_bd_pins xlslice_start_in/Dout] [get_bd_pins sparseDemo_0/start_in]
connect_bd_net [get_bd_pins xlslice_start_valid/Dout] [get_bd_pins sparseDemo_0/start_valid]
connect_bd_net [get_bd_pins sparseDemo_0/start_ready] [get_bd_pins xlconcat_ctrl/In0]
connect_bd_net [get_bd_pins xlslice_end_ready/Dout] [get_bd_pins sparseDemo_0/end_ready]
connect_bd_net [get_bd_pins xlconcat_ctrl/dout] [get_bd_pins ctrl_sparseDemo/gpio_io_i]
connect_bd_net [get_bd_pins ctrl_sparseDemo/gpio_io_o] \
  [get_bd_pins xlslice_start_in/Din] [get_bd_pins xlslice_start_valid/Din] [get_bd_pins xlslice_end_ready/Din] \
  [get_bd_pins xlslice_sel/Din]
connect_bd_net [get_bd_pins xlslice_sel/Dout] \
  [get_bd_pins bram_A_id/sel] [get_bd_pins bram_A_ptr/sel] [get_bd_pins bram_A_val/sel] [get_bd_pins bram_B_ptr/sel] \
  [get_bd_pins bram_B_id/sel] [get_bd_pins bram_B_val/sel] [get_bd_pins bram_C/sel]
connect_bd_net -net microblaze_0_Clk [get_bd_pins s_axi_aclk] \
  [get_bd_pins ctrl_sparseDemo/s_axi_aclk] [get_bd_pins axi_interconnect_0/ACLK] [get_bd_pins axi_interconnect_0/S00_ACLK] \
  [get_bd_pins axi_interconnect_0/M00_ACLK] [get_bd_pins axi_interconnect_0/M01_ACLK] \
  [get_bd_pins axi_interconnect_0/M02_ACLK] [get_bd_pins axi_interconnect_0/M03_ACLK] \
  [get_bd_pins axi_interconnect_0/M04_ACLK] [get_bd_pins axi_interconnect_0/M05_ACLK] \
  [get_bd_pins axi_interconnect_0/M06_ACLK] [get_bd_pins axi_interconnect_0/M07_ACLK] [get_bd_pins bram_A_id/clk1] \
  [get_bd_pins bram_A_ptr/clk1] [get_bd_pins bram_A_val/clk1] [get_bd_pins bram_B_ptr/clk1] [get_bd_pins bram_B_id/clk1] \
  [get_bd_pins bram_B_val/clk1] [get_bd_pins bram_C/clk1] [get_bd_pins sparseDemo_0/clk]
connect_bd_net -net rst_clk_wiz_0_100M_mb_reset [get_bd_pins rst1] \
  [get_bd_pins bram_A_id/rst1] [get_bd_pins bram_A_ptr/rst1] [get_bd_pins bram_A_val/rst1] [get_bd_pins bram_B_ptr/rst1] \
  [get_bd_pins bram_B_id/rst1] [get_bd_pins bram_B_val/rst1] [get_bd_pins bram_C/rst1] [get_bd_pins sparseDemo_0/rst]
connect_bd_net -net rst_clk_wiz_0_100M_peripheral_aresetn [get_bd_pins s_axi_aresetn] \
  [get_bd_pins ctrl_sparseDemo/s_axi_aresetn] [get_bd_pins axi_interconnect_0/S00_ARESETN] \
  [get_bd_pins axi_interconnect_0/M00_ARESETN] [get_bd_pins axi_interconnect_0/M01_ARESETN] \
  [get_bd_pins axi_interconnect_0/M02_ARESETN] [get_bd_pins axi_interconnect_0/M03_ARESETN] \
  [get_bd_pins axi_interconnect_0/M04_ARESETN] [get_bd_pins axi_interconnect_0/M05_ARESETN] \
  [get_bd_pins axi_interconnect_0/M06_ARESETN] [get_bd_pins axi_interconnect_0/M07_ARESETN] \
  [get_bd_pins bram_A_id/s_axi_aresetn] [get_bd_pins bram_A_ptr/s_axi_aresetn] [get_bd_pins bram_A_val/s_axi_aresetn] \
  [get_bd_pins bram_B_ptr/s_axi_aresetn] [get_bd_pins bram_B_id/s_axi_aresetn] [get_bd_pins bram_B_val/s_axi_aresetn] \
  [get_bd_pins bram_C/s_axi_aresetn] [get_bd_pins axi_interconnect_0/ARESETN]
connect_bd_net [get_bd_pins ctrl_sparseDemo/ip2intc_irpt] [get_bd_pins ip2intc_irpt]
connect_bd_net [get_bd_pins sparseDemo_0/end_valid] [get_bd_pins xlconcat_ctrl/In1]
connect_bd_net [get_bd_pins xlconstant_0/dout] [get_bd_pins xlconcat_ctrl/In2]
